# EAGLE design piezo-driver_v0.9b-R001 (EAGLE 6.5.0)

## Sheet 1 of 3
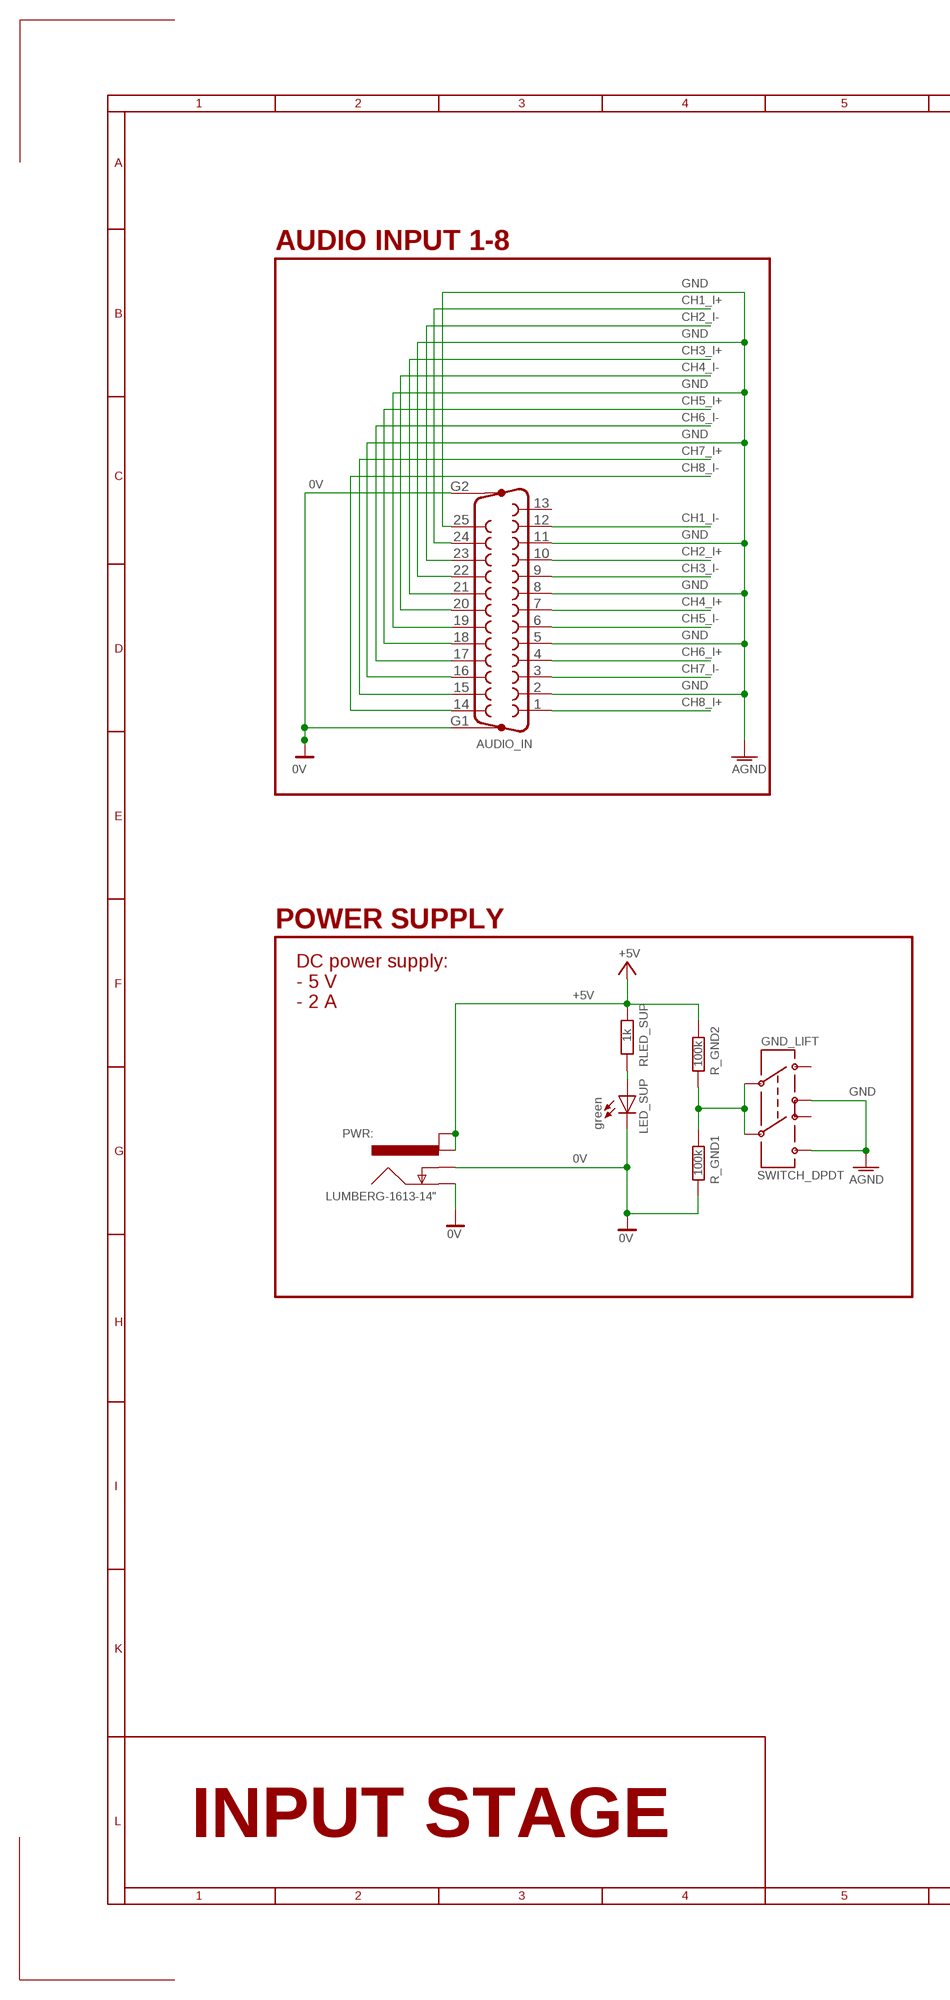
[diagram p0: schematic, sheet 1, part 1 of 2]
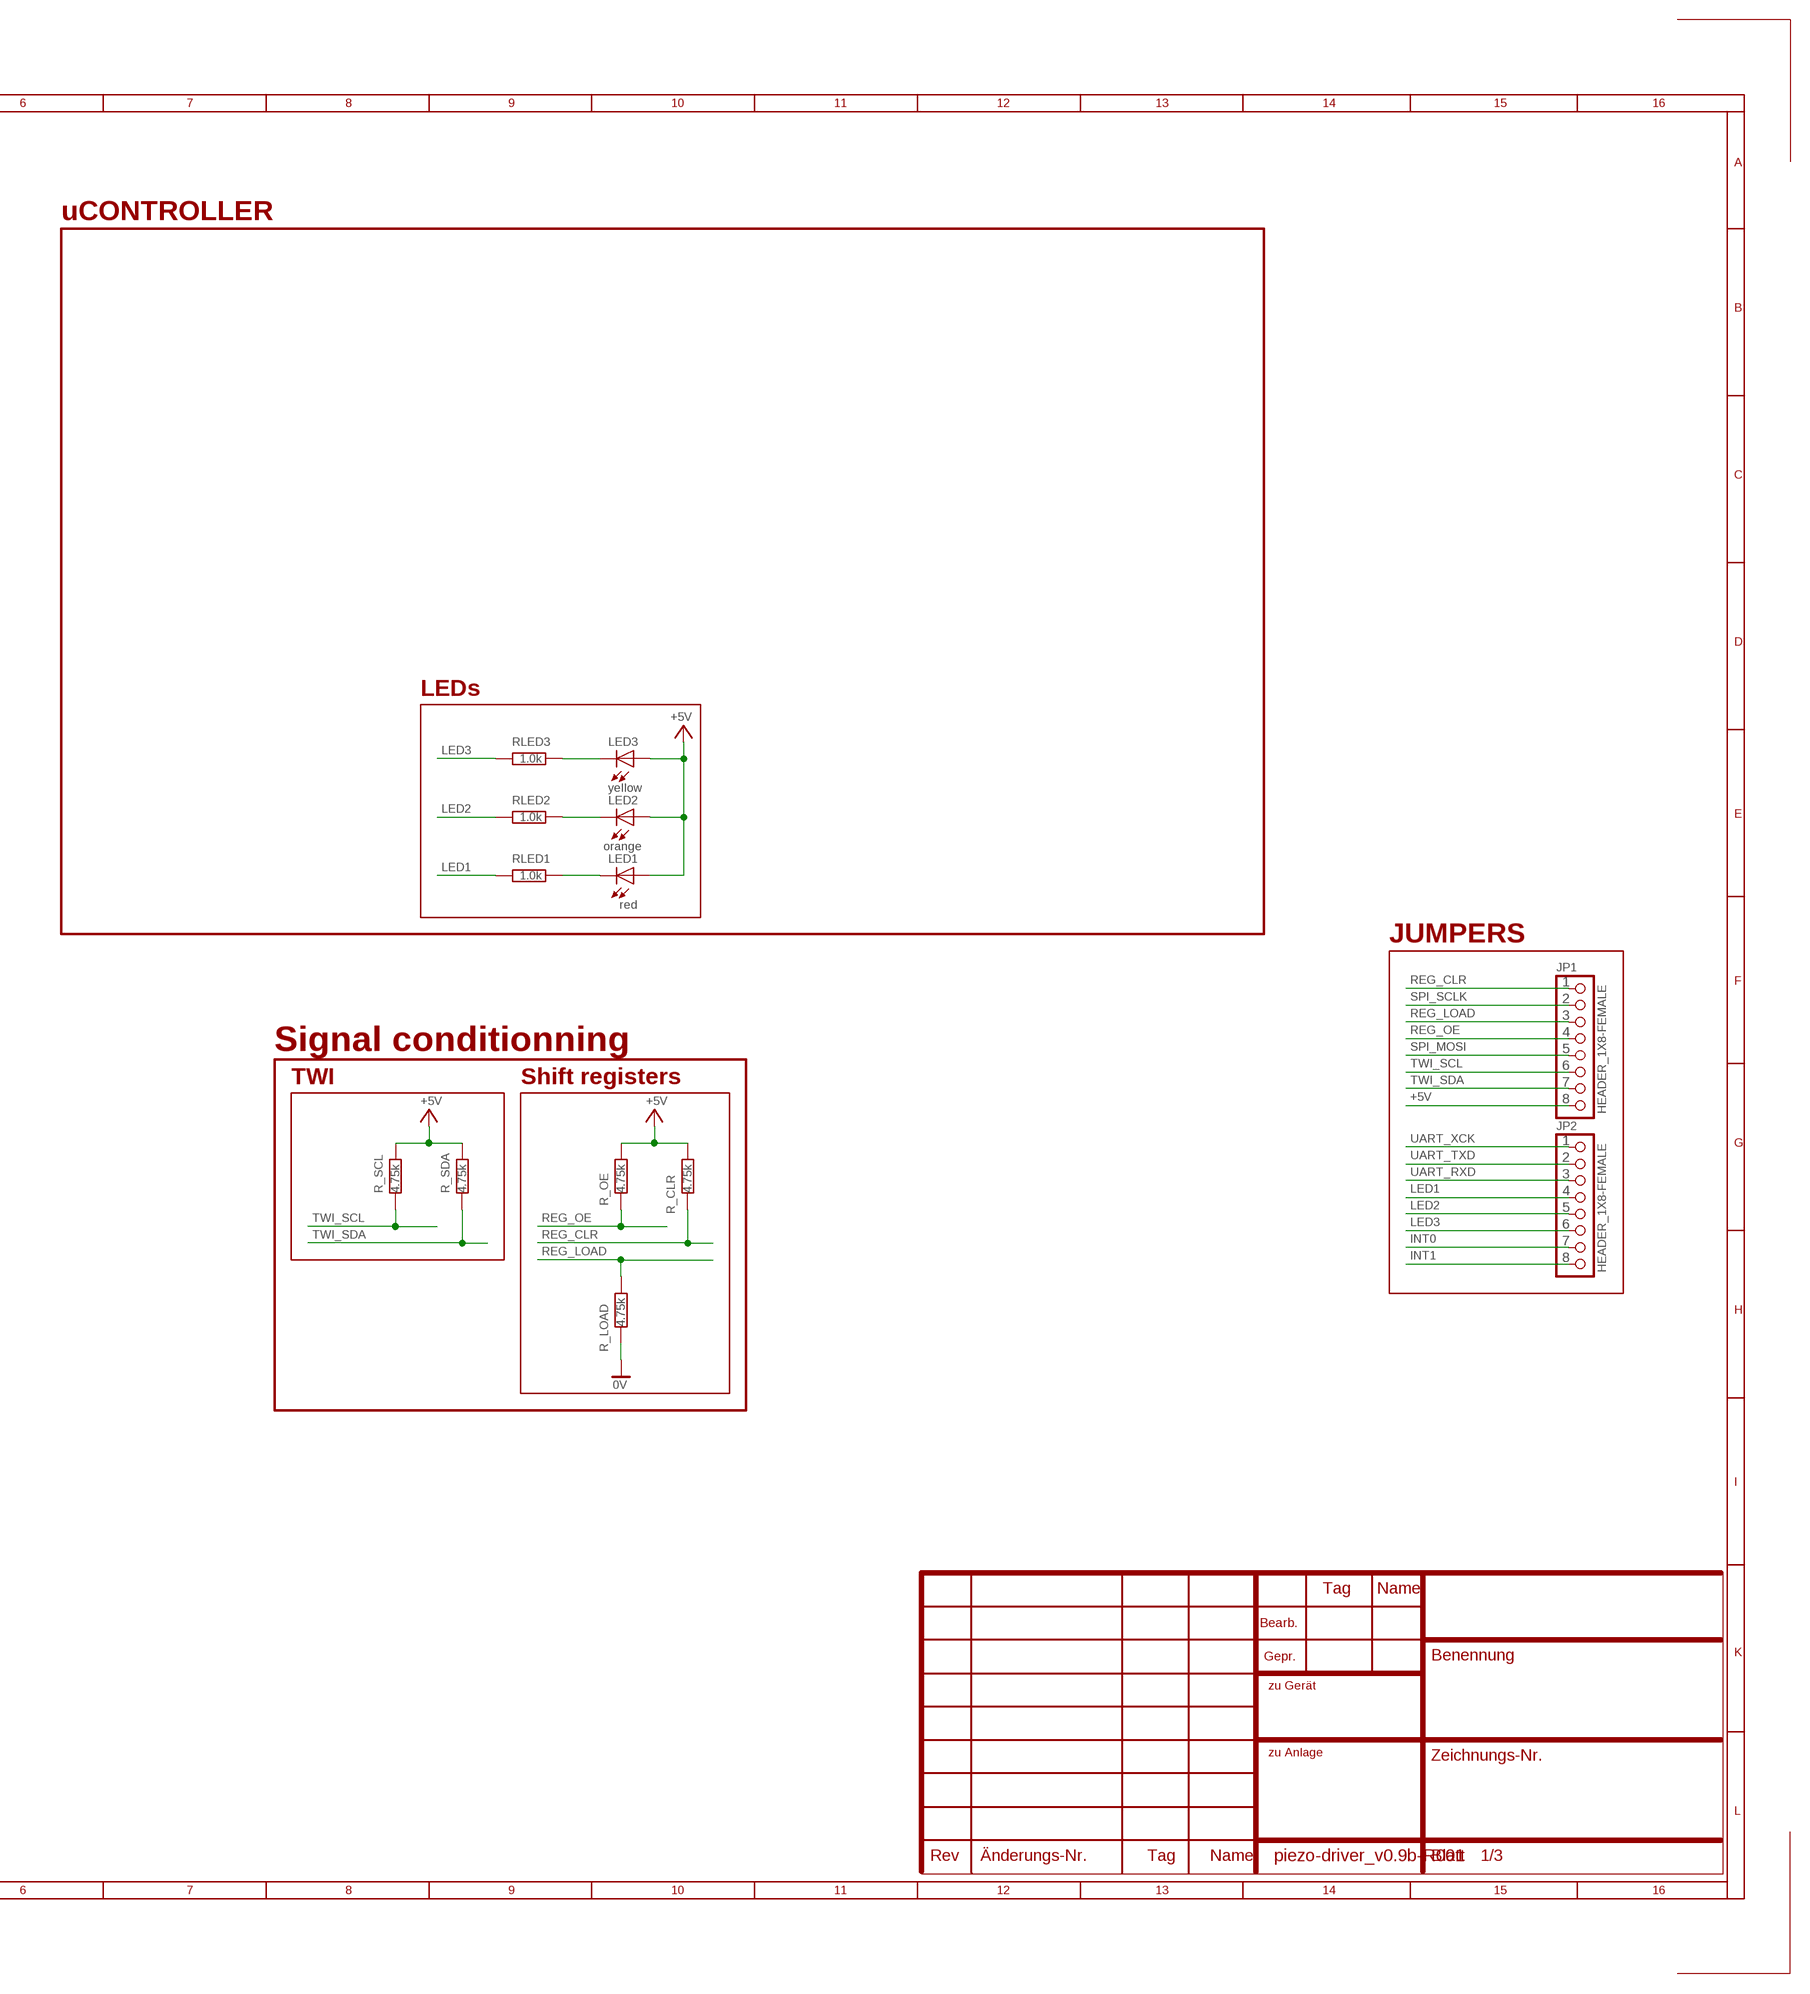
[diagram p1: schematic, sheet 1, part 2 of 2]

### Parts
AUDIO_IN  F25HP  [F25HP]
GND_LIFT  SWITCH_DPDT  [SWITCH_JS202011]
JP1  HEADER_1X8-FEMALE  [1X08_2.54]
JP2  HEADER_1X8-FEMALE  [1X08_2.54]
LED1  red  LED1206  [LED-1206]
LED2  orange  LED1206  [LED-1206]
LED3  yellow  LED1206  [LED-1206]
LED_SUP  green  LED1206  [LED-1206]
PWR:  LUMBERG-1613-14"  [LUMBERG-1613_14]
R_CLR  4.75k  R-EU_R0402  [R0402]
R_GND1  100k  R-EU_R0402  [R0402]
R_GND2  100k  R-EU_R0402  [R0402]
R_LOAD  4.75k  R-EU_R0402  [R0402]
R_OE  4.75k  R-EU_R0402  [R0402]
R_SCL  4.75k  R-EU_R0402  [R0402]
R_SDA  4.75k  R-EU_R0402  [R0402]
RLED1  1.0k  R-EU_R0402  [R0402]
RLED2  1.0k  R-EU_R0402  [R0402]
RLED3  1.0k  R-EU_R0402  [R0402]
RLED_SUP  1k  R-EU_R0402  [R0402]

### Nets
0V: AUDIO_IN.G1 AUDIO_IN.G2 LED_SUP.C PWR:.1(GND) PWR:.2(GND_INS) R_GND1.1 R_LOAD.1 ; also sheet 2,3
+5V: JP1.8 LED1.A LED2.A LED3.A PWR:.3(PWR_1) PWR:.4(PWR_2) R_CLR.2 R_GND2.2 R_OE.2 R_SCL.2 R_SDA.2 RLED_SUP.2 ; also sheet 2,3
CH1_I+: AUDIO_IN.24 ; also sheet 2
CH1_I-: AUDIO_IN.12 ; also sheet 2
CH2_I+: AUDIO_IN.10 ; also sheet 2
CH2_I-: AUDIO_IN.23 ; also sheet 2
CH3_I+: AUDIO_IN.21
CH3_I-: AUDIO_IN.9
CH4_I+: AUDIO_IN.7
CH4_I-: AUDIO_IN.20
CH5_I+: AUDIO_IN.18
CH5_I-: AUDIO_IN.6
CH6_I+: AUDIO_IN.4
CH6_I-: AUDIO_IN.17
CH7_I+: AUDIO_IN.15
CH7_I-: AUDIO_IN.3
CH8_I+: AUDIO_IN.1
CH8_I-: AUDIO_IN.14
GND: AUDIO_IN.2 AUDIO_IN.5 AUDIO_IN.8 AUDIO_IN.11 AUDIO_IN.16 AUDIO_IN.19 AUDIO_IN.22 AUDIO_IN.25 GND_LIFT.1(T1A) GND_LIFT.6(T2A) ; supply symbol labelled AGND
INT0: JP2.7
INT1: JP2.8
LED1: JP2.4 RLED1.1
LED2: JP2.5 RLED2.1
LED3: JP2.6 RLED3.1
N$15: LED_SUP.A RLED_SUP.1
N$68: LED3.C RLED3.2
N$69: LED2.C RLED2.2
N$70: LED1.C RLED1.2
N$1222: GND_LIFT.2(P1) GND_LIFT.5(P2) R_GND1.2 R_GND2.1
REG_CLR: JP1.1 R_CLR.1 ; also sheet 3
REG_LOAD: JP1.3 R_LOAD.2 ; also sheet 3
REG_OE: JP1.4 R_OE.1 ; also sheet 3
SPI_MOSI: JP1.5 ; also sheet 3
SPI_SCLK: JP1.2 ; also sheet 3
TWI_SCL: JP1.6 R_SCL.1 ; also sheet 2
TWI_SDA: JP1.7 R_SDA.1 ; also sheet 2
UART_RXD: JP2.3
UART_TXD: JP2.2
UART_XCK: JP2.1
Unconnected: AUDIO_IN.13 GND_LIFT.3(T1B) GND_LIFT.4(T2B)

### Notes on the sheet
- uCONTROLLER
- AUDIO INPUT 1-8
- LEDs
- POWER SUPPLY
- JUMPERS
- DC power supply:
  - 5 V
  - 2 A
- Signal conditionning
- TWI | Shift registers
- INPUT STAGE

## Sheet 2 of 3
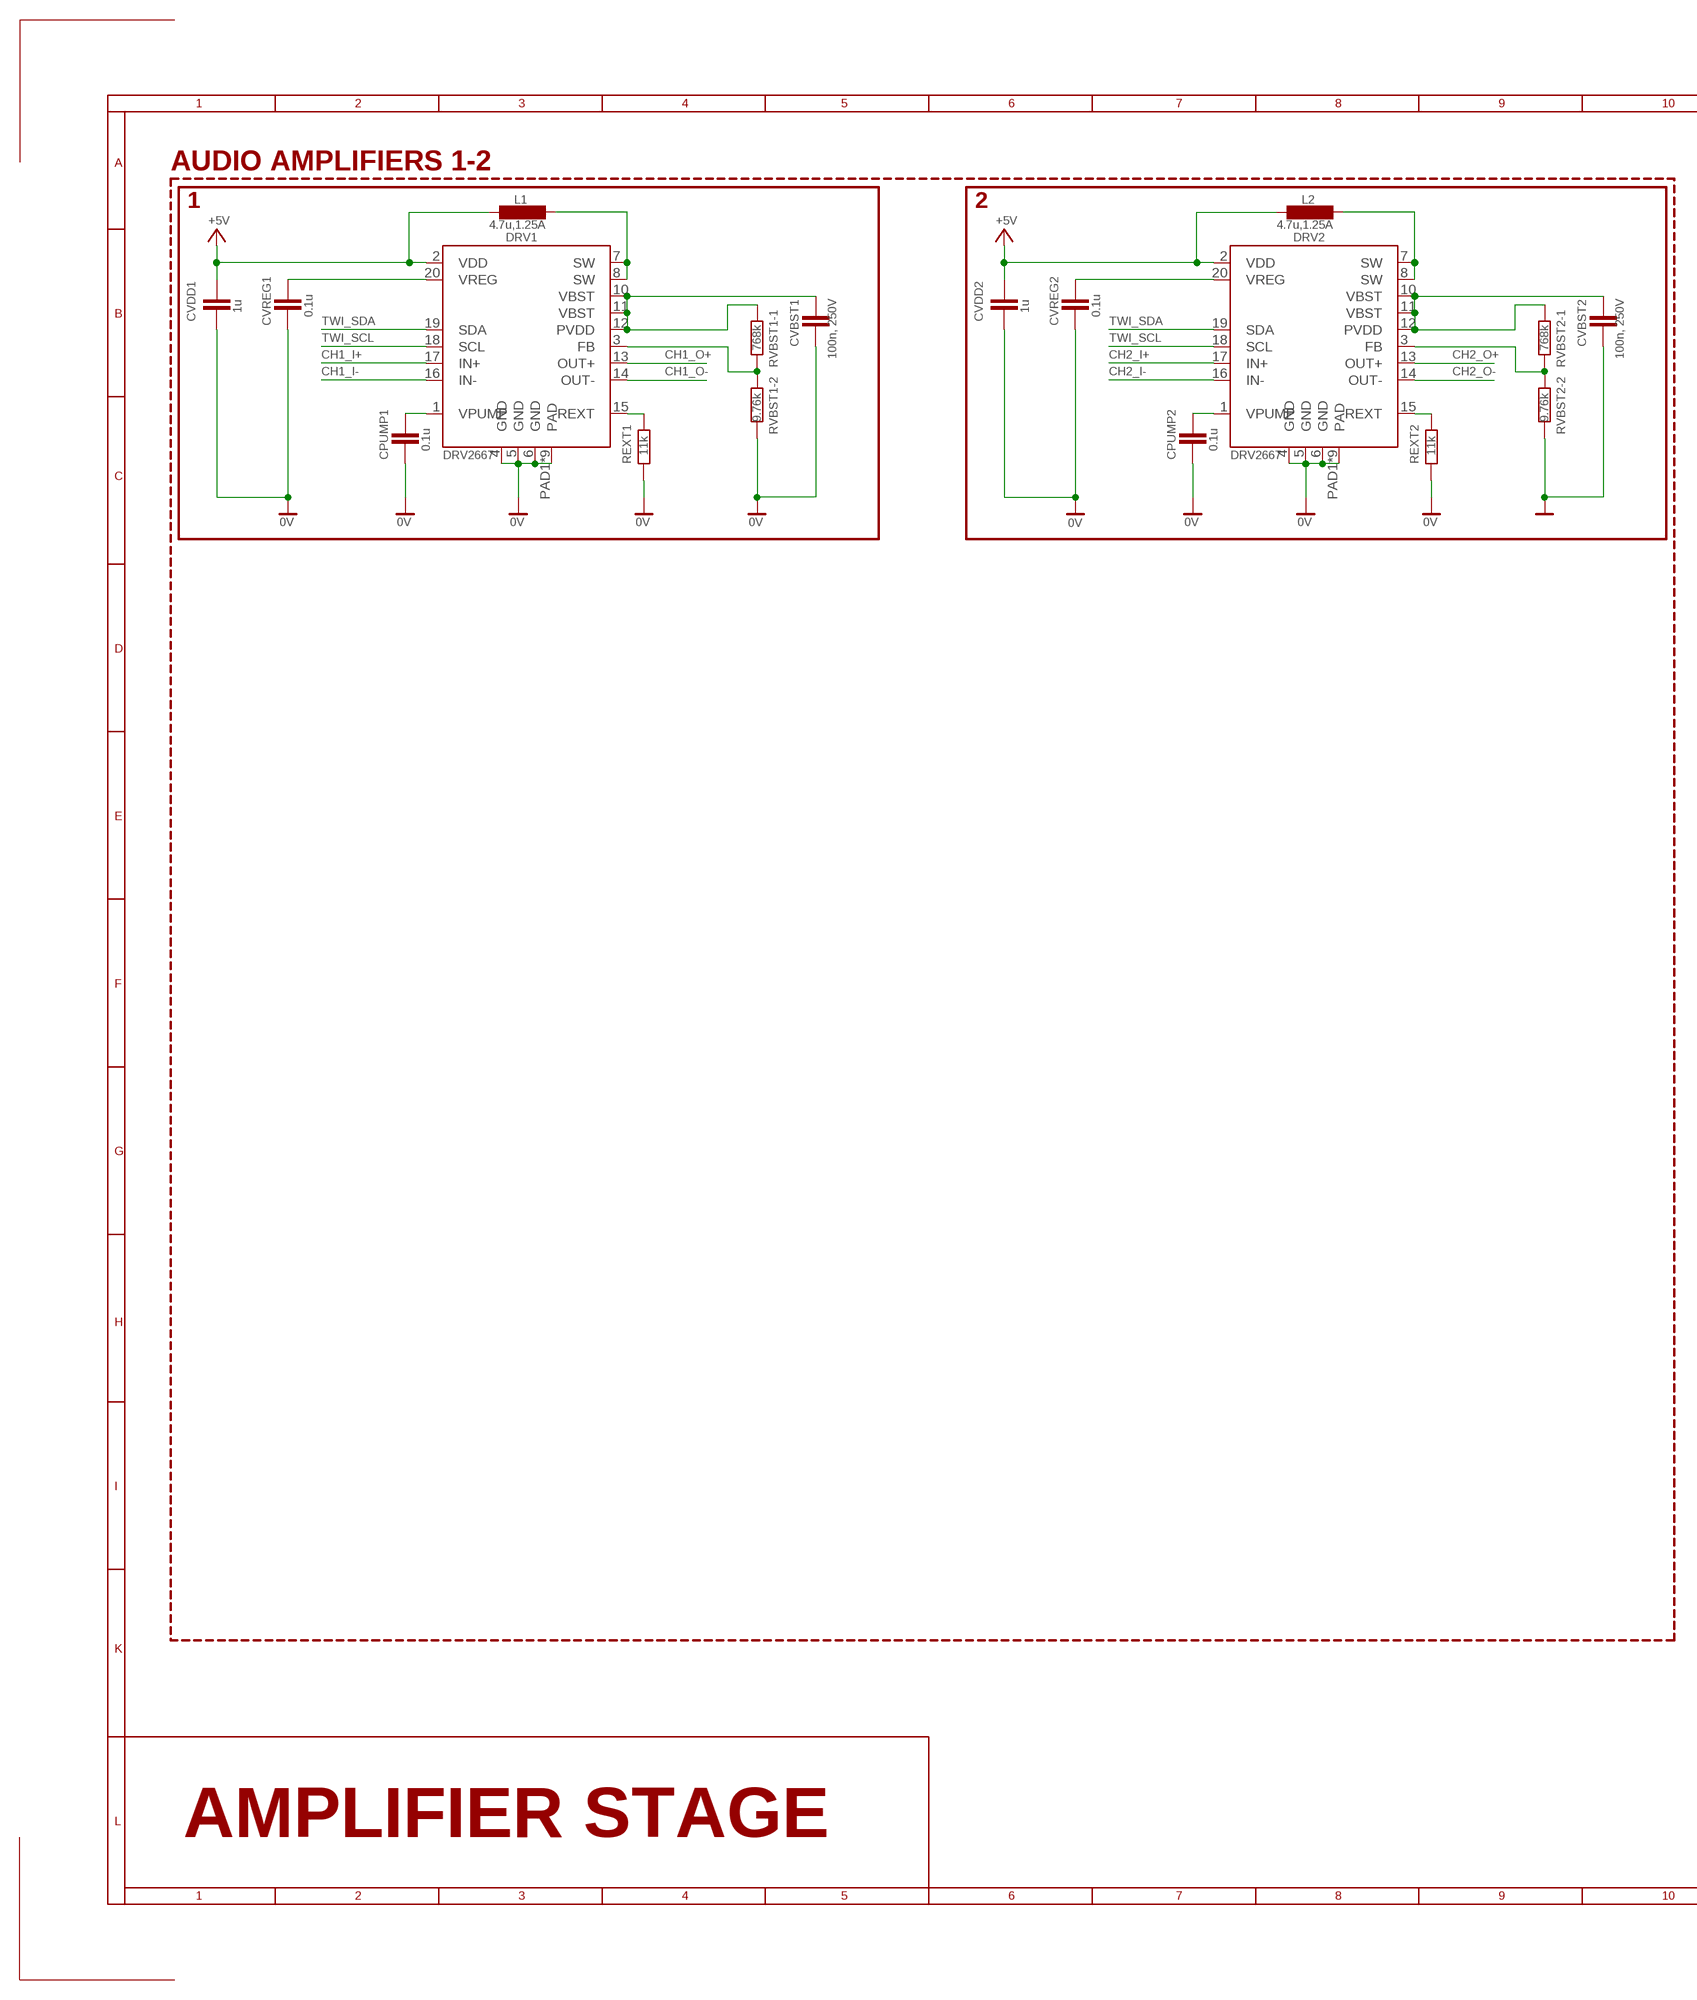
[diagram p2: schematic, sheet 2, part 1 of 2]
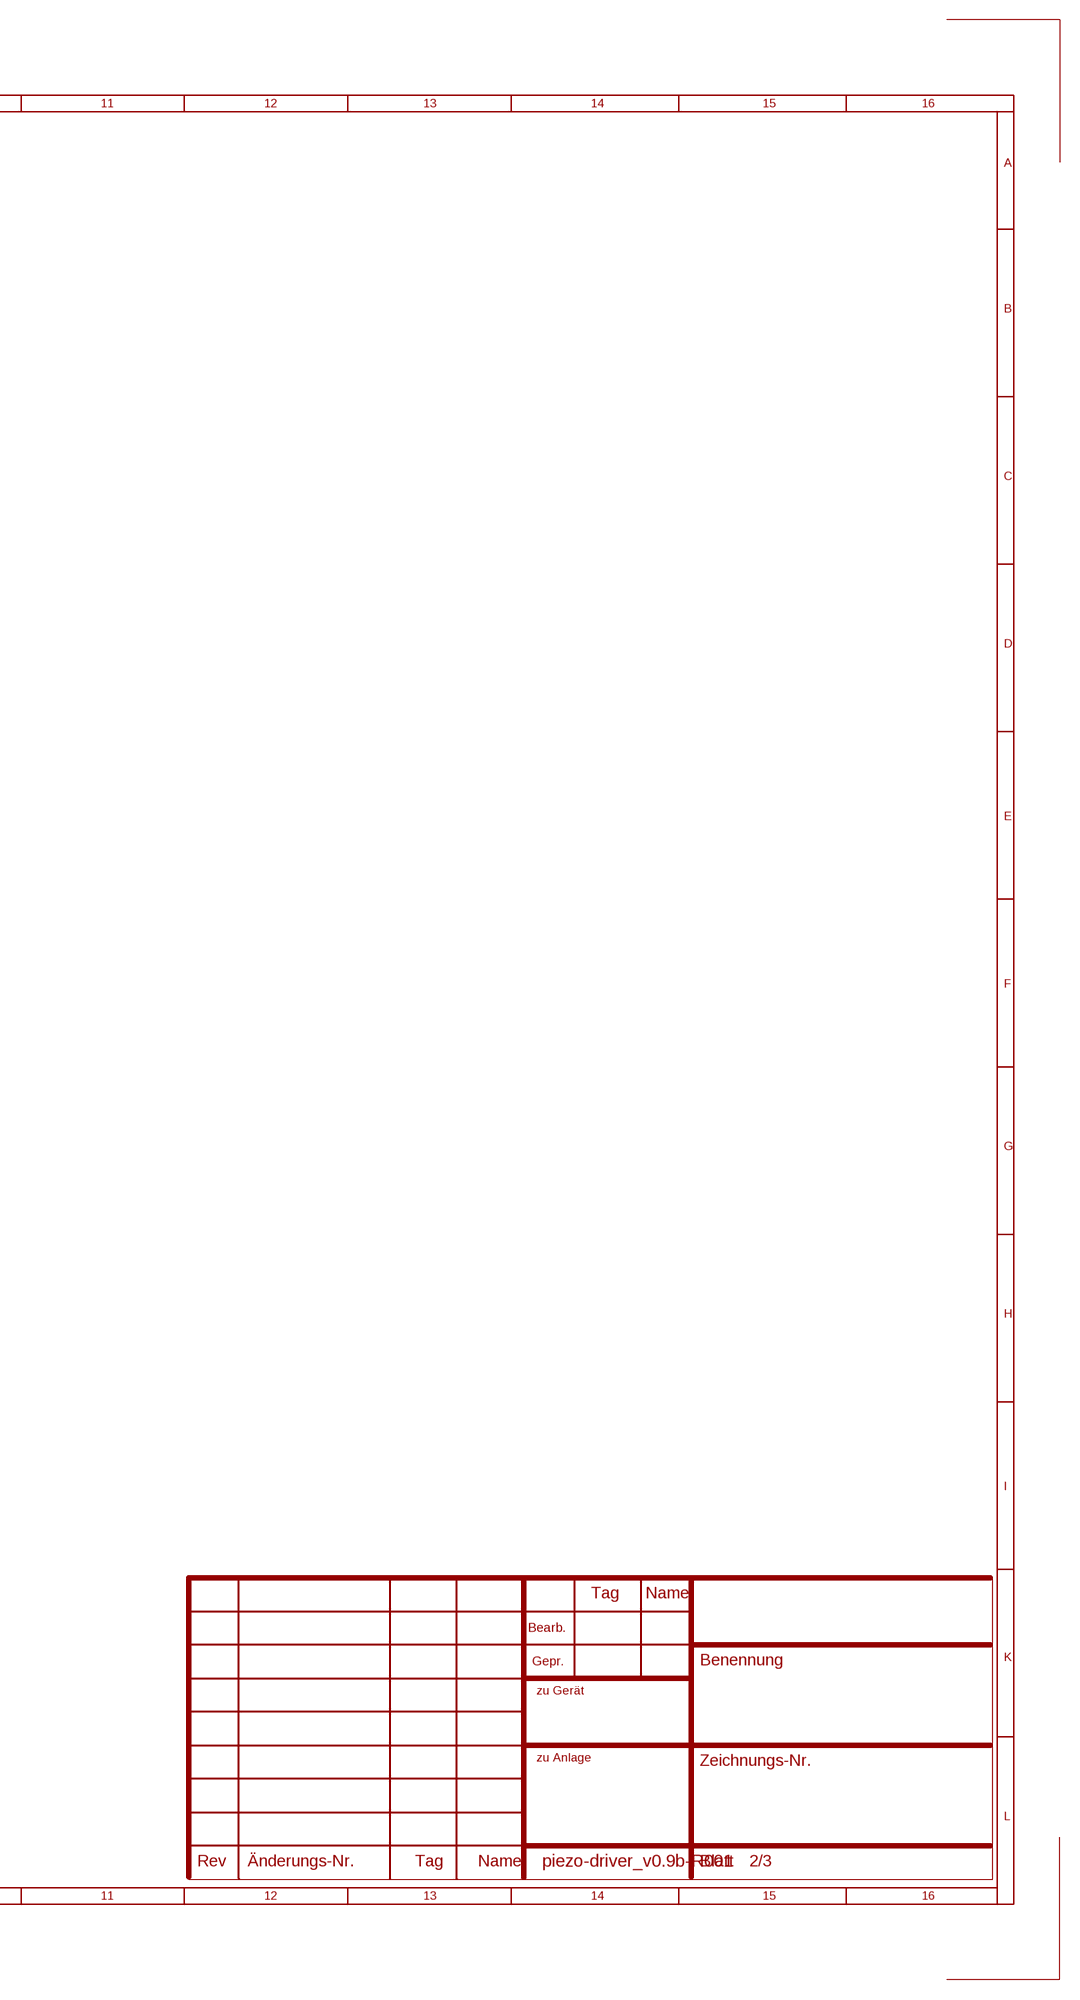
[diagram p3: schematic, sheet 2, part 2 of 2]

### Parts
CPUMP1  0.1u  C-EUC0402  [C0402]
CPUMP2  0.1u  C-EUC0402  [C0402]
CVBST1  100n, 250V  C-EUC0805  [C0805]
CVBST2  100n, 250V  C-EUC0805  [C0805]
CVDD1  1u  C-EUC0402  [C0402]
CVDD2  1u  C-EUC0402  [C0402]
CVREG1  0.1u  C-EUC0402  [C0402]
CVREG2  0.1u  C-EUC0402  [C0402]
DRV1  DRV2667  [QFN-20_9TH]
DRV2  DRV2667  [QFN-20_9TH]
L1  4.7u,1.25A  L-EUL3030  [L3030]
L2  4.7u,1.25A  L-EUL3030  [L3030]
REXT1  11k  R-EU_R0402  [R0402]
REXT2  11k  R-EU_R0402  [R0402]
RVBST1-1  768k  R-EU_R0402  [R0402]
RVBST1-2  9.76k  R-EU_R0402  [R0402]
RVBST2-1  768k  R-EU_R0402  [R0402]
RVBST2-2  9.76k  R-EU_R0402  [R0402]

### Nets
0V: CPUMP1.2 CPUMP2.2 CVBST1.2 CVBST2.2 CVDD1.2 CVDD2.2 CVREG1.2 CVREG2.2 DRV1.4(GND) DRV1.5(GND) DRV1.6(GND) DRV1.PAD1(PAD) DRV1.PAD2(PAD) DRV1.PAD3(PAD) DRV1.PAD4(PAD) DRV1.PAD5(PAD) DRV1.PAD6(PAD) DRV1.PAD7(PAD) DRV1.PAD8(PAD) DRV1.PAD9(PAD) DRV2.4(GND) DRV2.5(GND) DRV2.6(GND) DRV2.PAD1(PAD) DRV2.PAD2(PAD) DRV2.PAD3(PAD) DRV2.PAD4(PAD) DRV2.PAD5(PAD) DRV2.PAD6(PAD) DRV2.PAD7(PAD) DRV2.PAD8(PAD) DRV2.PAD9(PAD) REXT1.1 REXT2.1 RVBST1-2.1 RVBST2-2.1 ; also sheet 1,3
+5V: CVDD1.1 CVDD2.1 DRV1.2(VDD) DRV2.2(VDD) L1.2 L2.2 ; also sheet 1,3
CH1_I+: DRV1.17(IN+) ; also sheet 1
CH1_I-: DRV1.16(IN-) ; also sheet 1
CH1_O+: DRV1.13(OUT+) ; also sheet 3
CH1_O-: DRV1.14(OUT-) ; also sheet 3
CH2_I+: DRV2.17(IN+) ; also sheet 1
CH2_I-: DRV2.16(IN-) ; also sheet 1
CH2_O+: DRV2.13(OUT+) ; also sheet 3
CH2_O-: DRV2.14(OUT-) ; also sheet 3
N$2: DRV1.7(SW) DRV1.8(SW) L1.1
N$3: CVBST1.1 DRV1.10(VBST) DRV1.11(VBST) DRV1.12(PVDD) RVBST1-1.2
N$4: DRV1.3(FB) RVBST1-1.1 RVBST1-2.2
N$5: DRV1.15(REXT) REXT1.2
N$6: CPUMP1.1 DRV1.1(VPUMP)
N$7: CVREG1.1 DRV1.20(VREG)
N$21: DRV2.7(SW) DRV2.8(SW) L2.1
N$22: CVBST2.1 DRV2.10(VBST) DRV2.11(VBST) DRV2.12(PVDD) RVBST2-1.2
N$23: DRV2.3(FB) RVBST2-1.1 RVBST2-2.2
N$24: DRV2.15(REXT) REXT2.2
N$25: CPUMP2.1 DRV2.1(VPUMP)
N$26: CVREG2.1 DRV2.20(VREG)
TWI_SCL: DRV1.18(SCL) DRV2.18(SCL) ; also sheet 1
TWI_SDA: DRV1.19(SDA) DRV2.19(SDA) ; also sheet 1

### Notes on the sheet
- AUDIO AMPLIFIERS 1-2
- 1 | 2
- AMPLIFIER STAGE

## Sheet 3 of 3
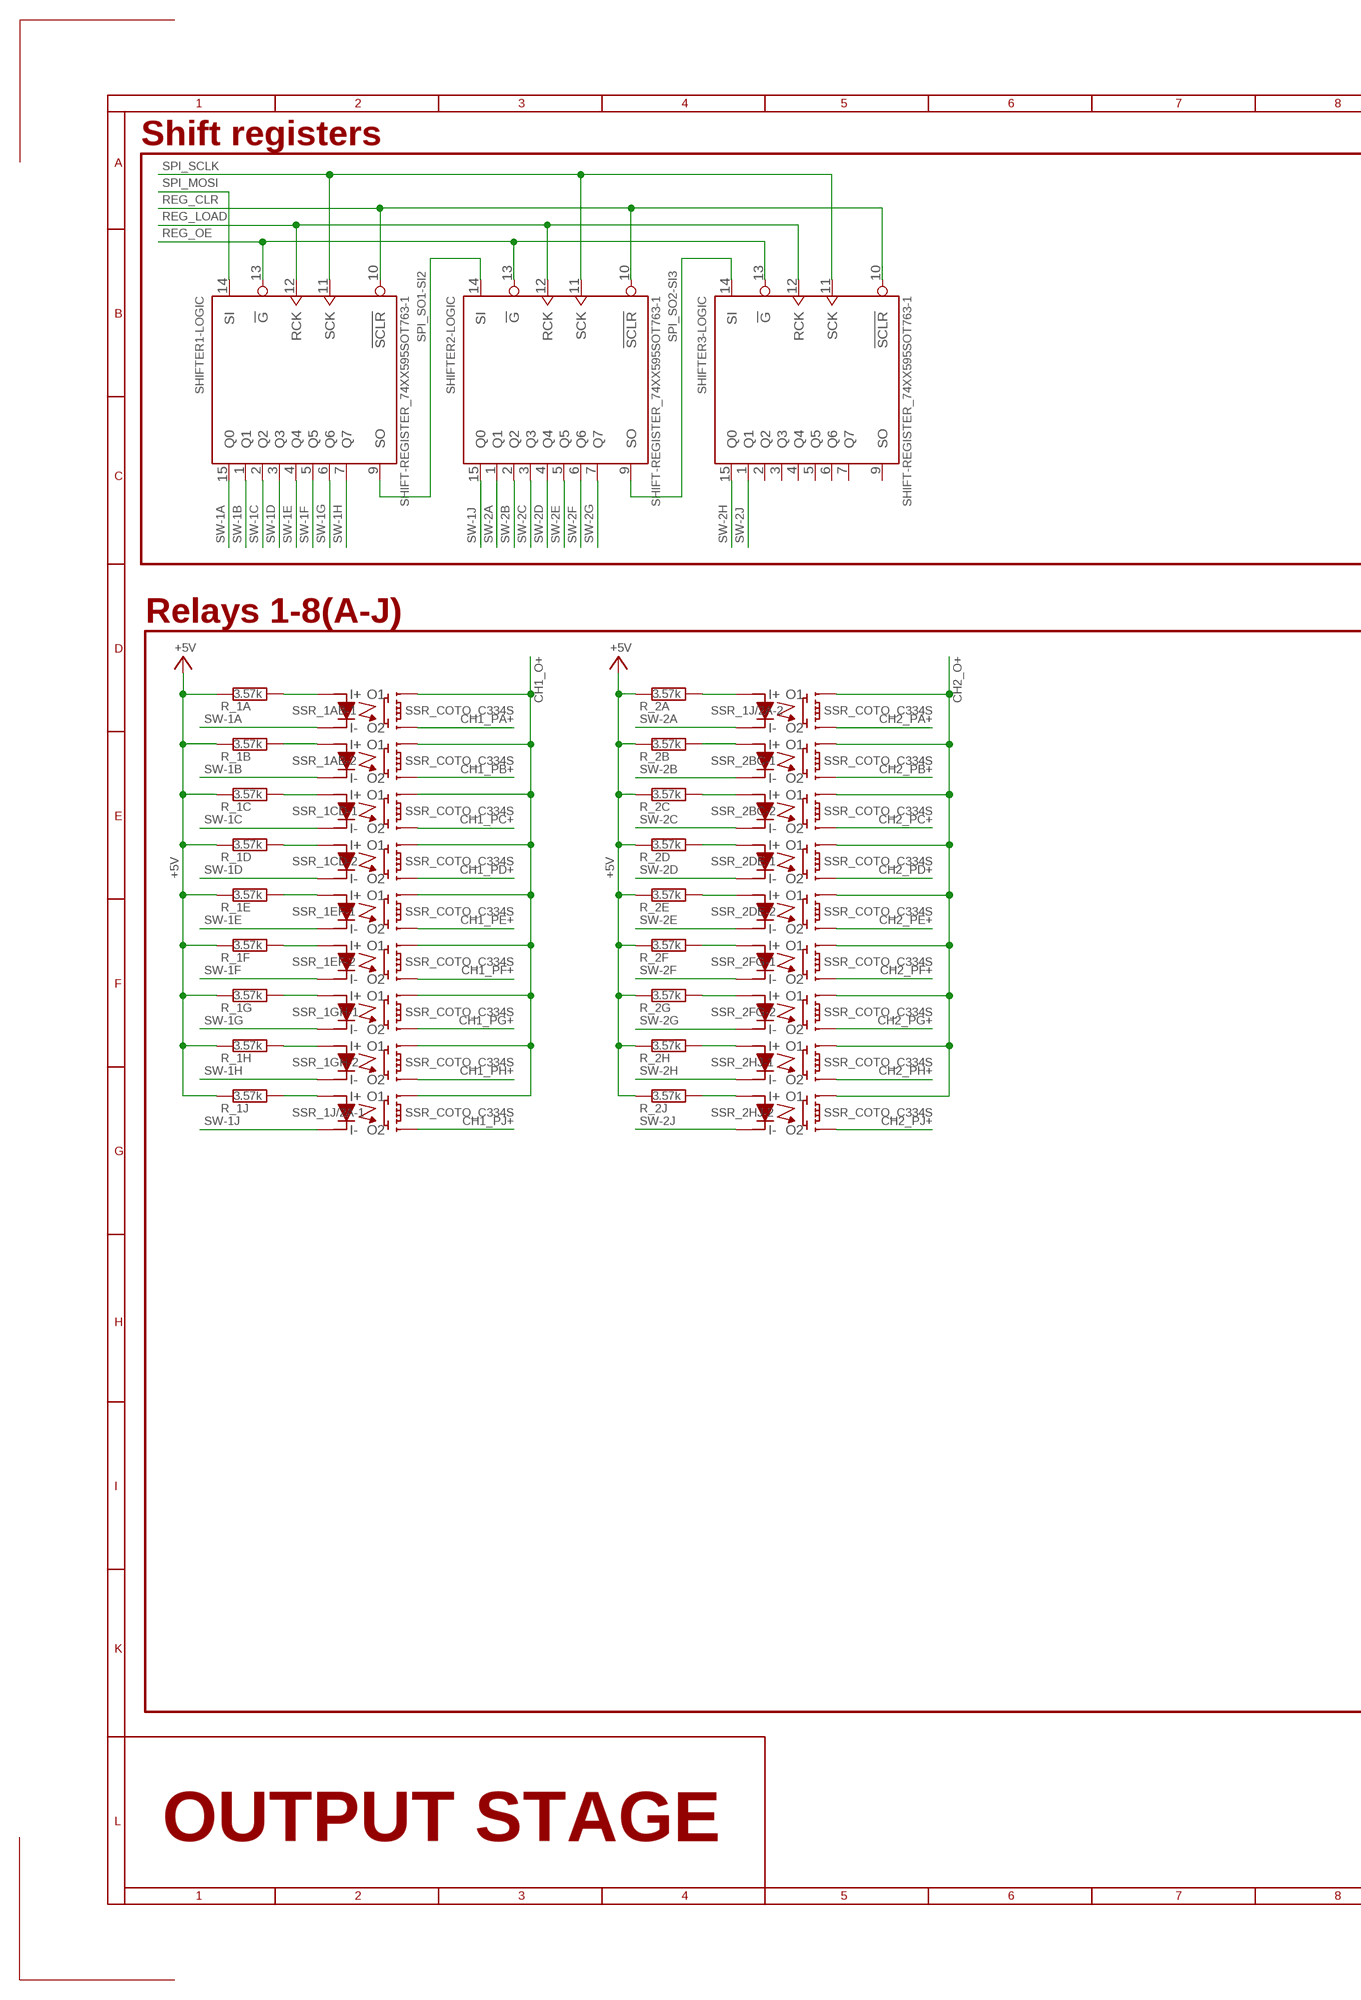
[diagram p4: schematic, sheet 3, part 1 of 2]
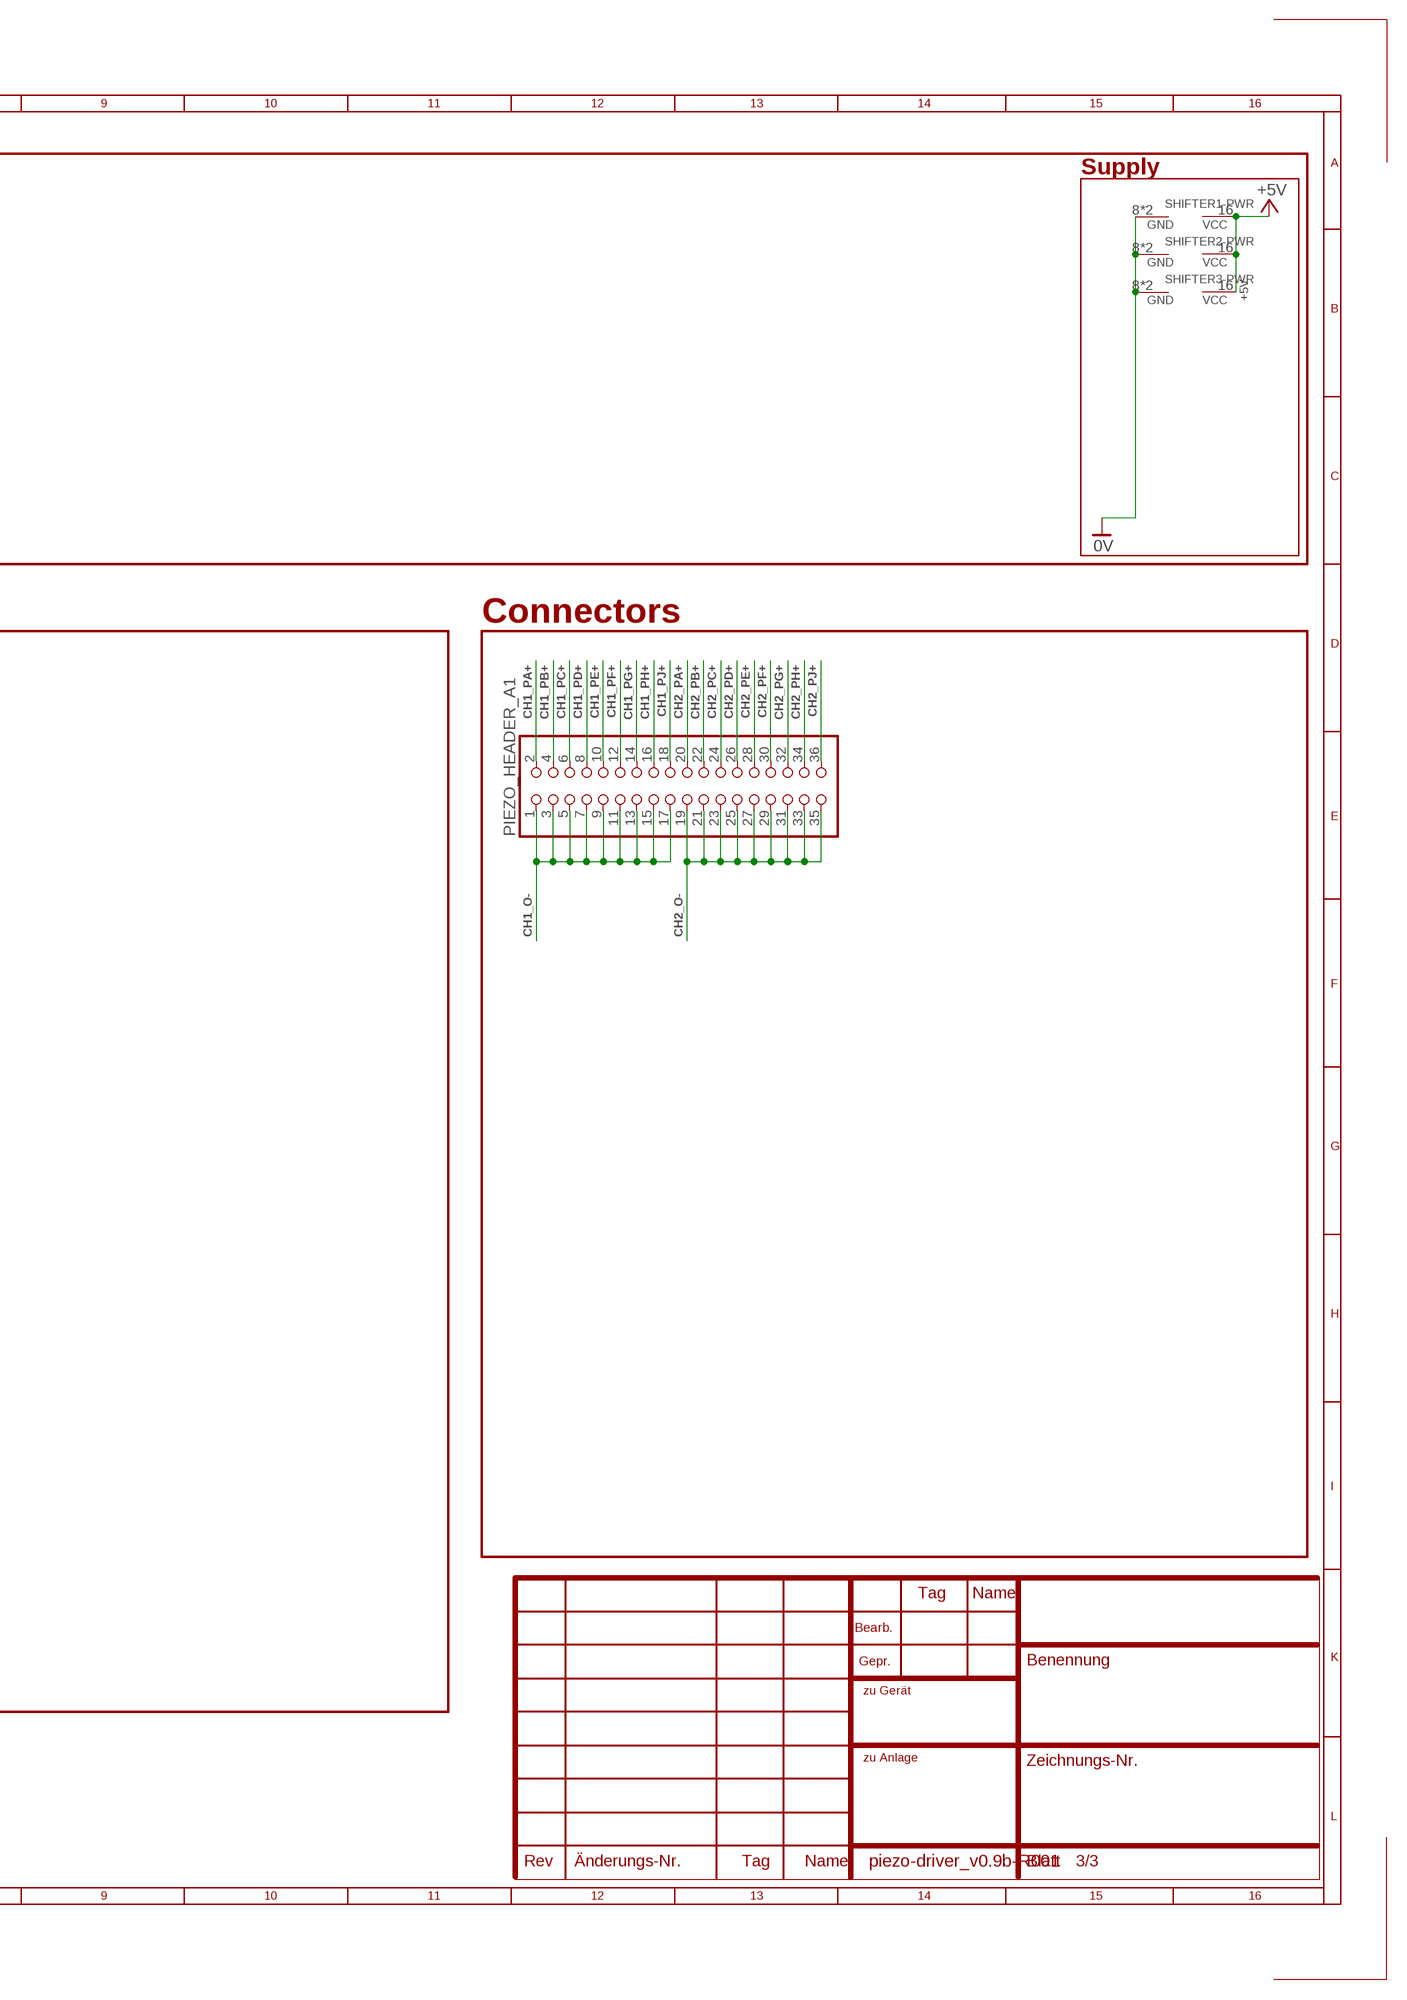
[diagram p5: schematic, sheet 3, part 2 of 2]

### Parts
PIEZO_HEADER_A1  PINHD-2X18  [2X18]
R_1A  3.57k  R-EU_R0402  [R0402]
R_1B  3.57k  R-EU_R0402  [R0402]
R_1C  3.57k  R-EU_R0402  [R0402]
R_1D  3.57k  R-EU_R0402  [R0402]
R_1E  3.57k  R-EU_R0402  [R0402]
R_1F  3.57k  R-EU_R0402  [R0402]
R_1G  3.57k  R-EU_R0402  [R0402]
R_1H  3.57k  R-EU_R0402  [R0402]
R_1J  3.57k  R-EU_R0402  [R0402]
R_2A  3.57k  R-EU_R0402  [R0402]
R_2B  3.57k  R-EU_R0402  [R0402]
R_2C  3.57k  R-EU_R0402  [R0402]
R_2D  3.57k  R-EU_R0402  [R0402]
R_2E  3.57k  R-EU_R0402  [R0402]
R_2F  3.57k  R-EU_R0402  [R0402]
R_2G  3.57k  R-EU_R0402  [R0402]
R_2H  3.57k  R-EU_R0402  [R0402]
R_2J  3.57k  R-EU_R0402  [R0402]
SHIFTER1  SHIFT-REGISTER_74XX595SOT763-1  [SOT763-1]
SHIFTER2  SHIFT-REGISTER_74XX595SOT763-1  [SOT763-1]
SHIFTER3  SHIFT-REGISTER_74XX595SOT763-1  [SOT763-1]
SSR_1AB  SSR_COTO_C334S  [SOP8]
SSR_1CD  SSR_COTO_C334S  [SOP8]
SSR_1EF  SSR_COTO_C334S  [SOP8]
SSR_1GH  SSR_COTO_C334S  [SOP8]
SSR_1J/2A  SSR_COTO_C334S  [SOP8]
SSR_2BC  SSR_COTO_C334S  [SOP8]
SSR_2DE  SSR_COTO_C334S  [SOP8]
SSR_2FG  SSR_COTO_C334S  [SOP8]
SSR_2HJ  SSR_COTO_C334S  [SOP8]

### Nets
0V: SHIFTER1.8(-PWR:GND) SHIFTER1.PAD(-PWR:GND) SHIFTER2.8(-PWR:GND) SHIFTER2.PAD(-PWR:GND) SHIFTER3.8(-PWR:GND) SHIFTER3.PAD(-PWR:GND) ; also sheet 1,2
+5V: R_1A.2 R_1B.2 R_1C.2 R_1D.2 R_1E.2 R_1F.2 R_1G.2 R_1H.2 R_1J.2 R_2A.2 R_2B.2 R_2C.2 R_2D.2 R_2E.2 R_2F.2 R_2G.2 R_2H.2 R_2J.2 SHIFTER1.16(-PWR:VCC) SHIFTER2.16(-PWR:VCC) SHIFTER3.16(-PWR:VCC) ; also sheet 1,2
CH1_O+: SSR_1AB.5(-2:O1) SSR_1AB.7(-1:O1) SSR_1CD.5(-2:O1) SSR_1CD.7(-1:O1) SSR_1EF.5(-2:O1) SSR_1EF.7(-1:O1) SSR_1GH.5(-2:O1) SSR_1GH.7(-1:O1) SSR_1J/2A.7(-1:O1) ; also sheet 2
CH1_O-: PIEZO_HEADER_A1.1 PIEZO_HEADER_A1.3 PIEZO_HEADER_A1.5 PIEZO_HEADER_A1.7 PIEZO_HEADER_A1.9 PIEZO_HEADER_A1.11 PIEZO_HEADER_A1.13 PIEZO_HEADER_A1.15 PIEZO_HEADER_A1.17 ; also sheet 2
CH1_PA+: PIEZO_HEADER_A1.2 SSR_1AB.8(-1:O2)
CH1_PB+: PIEZO_HEADER_A1.4 SSR_1AB.6(-2:O2)
CH1_PC+: PIEZO_HEADER_A1.6 SSR_1CD.8(-1:O2)
CH1_PD+: PIEZO_HEADER_A1.8 SSR_1CD.6(-2:O2)
CH1_PE+: PIEZO_HEADER_A1.10 SSR_1EF.8(-1:O2)
CH1_PF+: PIEZO_HEADER_A1.12 SSR_1EF.6(-2:O2)
CH1_PG+: PIEZO_HEADER_A1.14 SSR_1GH.8(-1:O2)
CH1_PH+: PIEZO_HEADER_A1.16 SSR_1GH.6(-2:O2)
CH1_PJ+: PIEZO_HEADER_A1.18 SSR_1J/2A.8(-1:O2)
CH2_O+: SSR_1J/2A.5(-2:O1) SSR_2BC.5(-2:O1) SSR_2BC.7(-1:O1) SSR_2DE.5(-2:O1) SSR_2DE.7(-1:O1) SSR_2FG.5(-2:O1) SSR_2FG.7(-1:O1) SSR_2HJ.5(-2:O1) SSR_2HJ.7(-1:O1) ; also sheet 2
CH2_O-: PIEZO_HEADER_A1.19 PIEZO_HEADER_A1.21 PIEZO_HEADER_A1.23 PIEZO_HEADER_A1.25 PIEZO_HEADER_A1.27 PIEZO_HEADER_A1.29 PIEZO_HEADER_A1.31 PIEZO_HEADER_A1.33 PIEZO_HEADER_A1.35 ; also sheet 2
CH2_PA+: PIEZO_HEADER_A1.20 SSR_1J/2A.6(-2:O2)
CH2_PB+: PIEZO_HEADER_A1.22 SSR_2BC.8(-1:O2)
CH2_PC+: PIEZO_HEADER_A1.24 SSR_2BC.6(-2:O2)
CH2_PD+: PIEZO_HEADER_A1.26 SSR_2DE.8(-1:O2)
CH2_PE+: PIEZO_HEADER_A1.28 SSR_2DE.6(-2:O2)
CH2_PF+: PIEZO_HEADER_A1.30 SSR_2FG.8(-1:O2)
CH2_PG+: PIEZO_HEADER_A1.32 SSR_2FG.6(-2:O2)
CH2_PH+: PIEZO_HEADER_A1.34 SSR_2HJ.8(-1:O2)
CH2_PJ+: PIEZO_HEADER_A1.36 SSR_2HJ.6(-2:O2)
N$96: R_1A.1 SSR_1AB.1(-1:I+)
N$97: R_1B.1 SSR_1AB.3(-2:I+)
N$100: R_1C.1 SSR_1CD.1(-1:I+)
N$101: R_1D.1 SSR_1CD.3(-2:I+)
N$102: R_1E.1 SSR_1EF.1(-1:I+)
N$103: R_1F.1 SSR_1EF.3(-2:I+)
N$104: R_1G.1 SSR_1GH.1(-1:I+)
N$105: R_1H.1 SSR_1GH.3(-2:I+)
N$106: R_1J.1 SSR_1J/2A.1(-1:I+)
N$107: R_2A.1 SSR_1J/2A.3(-2:I+)
N$108: R_2B.1 SSR_2BC.1(-1:I+)
N$109: R_2C.1 SSR_2BC.3(-2:I+)
N$119: R_2D.1 SSR_2DE.1(-1:I+)
N$120: R_2E.1 SSR_2DE.3(-2:I+)
N$121: R_2F.1 SSR_2FG.1(-1:I+)
N$122: R_2J.1 SSR_2HJ.3(-2:I+)
N$123: R_2H.1 SSR_2HJ.1(-1:I+)
N$124: R_2G.1 SSR_2FG.3(-2:I+)
REG_CLR: SHIFTER1.10(-LOGIC:!SCLR) SHIFTER2.10(-LOGIC:!SCLR) SHIFTER3.10(-LOGIC:!SCLR) ; also sheet 1
REG_LOAD: SHIFTER1.12(-LOGIC:RCK) SHIFTER2.12(-LOGIC:RCK) SHIFTER3.12(-LOGIC:RCK) ; also sheet 1
REG_OE: SHIFTER1.13(-LOGIC:!G) SHIFTER2.13(-LOGIC:!G) SHIFTER3.13(-LOGIC:!G) ; also sheet 1
SPI_MOSI: SHIFTER1.14(-LOGIC:SI) ; also sheet 1
SPI_SCLK: SHIFTER1.11(-LOGIC:SCK) SHIFTER2.11(-LOGIC:SCK) SHIFTER3.11(-LOGIC:SCK) ; also sheet 1
SPI_SO1-SI2: SHIFTER1.9(-LOGIC:SO) SHIFTER2.14(-LOGIC:SI)
SPI_SO2-SI3: SHIFTER2.9(-LOGIC:SO) SHIFTER3.14(-LOGIC:SI)
SW-1A: SHIFTER1.15(-LOGIC:Q0) SSR_1AB.2(-1:I-)
SW-1B: SHIFTER1.1(-LOGIC:Q1) SSR_1AB.4(-2:I-)
SW-1C: SHIFTER1.2(-LOGIC:Q2) SSR_1CD.2(-1:I-)
SW-1D: SHIFTER1.3(-LOGIC:Q3) SSR_1CD.4(-2:I-)
SW-1E: SHIFTER1.4(-LOGIC:Q4) SSR_1EF.2(-1:I-)
SW-1F: SHIFTER1.5(-LOGIC:Q5) SSR_1EF.4(-2:I-)
SW-1G: SHIFTER1.6(-LOGIC:Q6) SSR_1GH.2(-1:I-)
SW-1H: SHIFTER1.7(-LOGIC:Q7) SSR_1GH.4(-2:I-)
SW-1J: SHIFTER2.15(-LOGIC:Q0) SSR_1J/2A.2(-1:I-)
SW-2A: SHIFTER2.1(-LOGIC:Q1) SSR_1J/2A.4(-2:I-)
SW-2B: SHIFTER2.2(-LOGIC:Q2) SSR_2BC.2(-1:I-)
SW-2C: SHIFTER2.3(-LOGIC:Q3) SSR_2BC.4(-2:I-)
SW-2D: SHIFTER2.4(-LOGIC:Q4) SSR_2DE.2(-1:I-)
SW-2E: SHIFTER2.5(-LOGIC:Q5) SSR_2DE.4(-2:I-)
SW-2F: SHIFTER2.6(-LOGIC:Q6) SSR_2FG.2(-1:I-)
SW-2G: SHIFTER2.7(-LOGIC:Q7) SSR_2FG.4(-2:I-)
SW-2H: SHIFTER3.15(-LOGIC:Q0) SSR_2HJ.2(-1:I-)
SW-2J: SHIFTER3.1(-LOGIC:Q1) SSR_2HJ.4(-2:I-)
Unconnected: SHIFTER3.2(-LOGIC:Q2) SHIFTER3.3(-LOGIC:Q3) SHIFTER3.4(-LOGIC:Q4) SHIFTER3.5(-LOGIC:Q5) SHIFTER3.6(-LOGIC:Q6) SHIFTER3.7(-LOGIC:Q7) SHIFTER3.9(-LOGIC:SO)

### Notes on the sheet
- Shift registers
- Supply
- Relays 1-8(A-J) | Connectors
- OUTPUT STAGE

## Library data of the parts
AUDIO_IN = ICST:F25HP: SUB-D; OC_FARNELL: unknown; OC_NEWARK: unknown
CPUMP1 CPUMP2 CVBST1 CVBST2 CVDD1 CVDD2 CVREG1 CVREG2 = SABRe:C-EU: CAPACITOR, European symbol
DRV1 DRV2 = ICST:DRV2667
GND_LIFT = ICST:SWITCH_DPDT
JP1 JP2 = SABRe:HEADER_1X8
L1 L2 = SABRe:L-EU: INDUCTOR, European symbol
LED1-LED3 LED_SUP = SABRe:LED: LEDs Standard schematic elements and footprints for packages: 5mm 3mm 1206 0603
PIEZO_HEADER_A1 = ICST:PINHD-2X18: PIN HEADER
PWR: = SABRe:LUMBERG-1613-14
R_1A R_1B R_1C R_1D R_1E R_1F R_1G R_1H R_1J R_2A R_2B R_2C R_2D R_2E R_2F R_2G R_2H R_2J R_CLR R_GND1 R_GND2 R_LOAD R_OE R_SCL R_SDA REXT1 REXT2 RLED1-RLED3 RLED_SUP RVBST1-1 RVBST1-2 RVBST2-1 RVBST2-2 = SABRe:R-EU_: RESISTOR, European symbol
SHIFTER1-SHIFTER3 = ICST:SHIFT-REGISTER_74XX595
SSR_1AB SSR_1CD SSR_1EF SSR_1GH SSR_1J/2A SSR_2BC SSR_2DE SSR_2FG SSR_2HJ = ICST:SSR_COTO_C334S

## Board
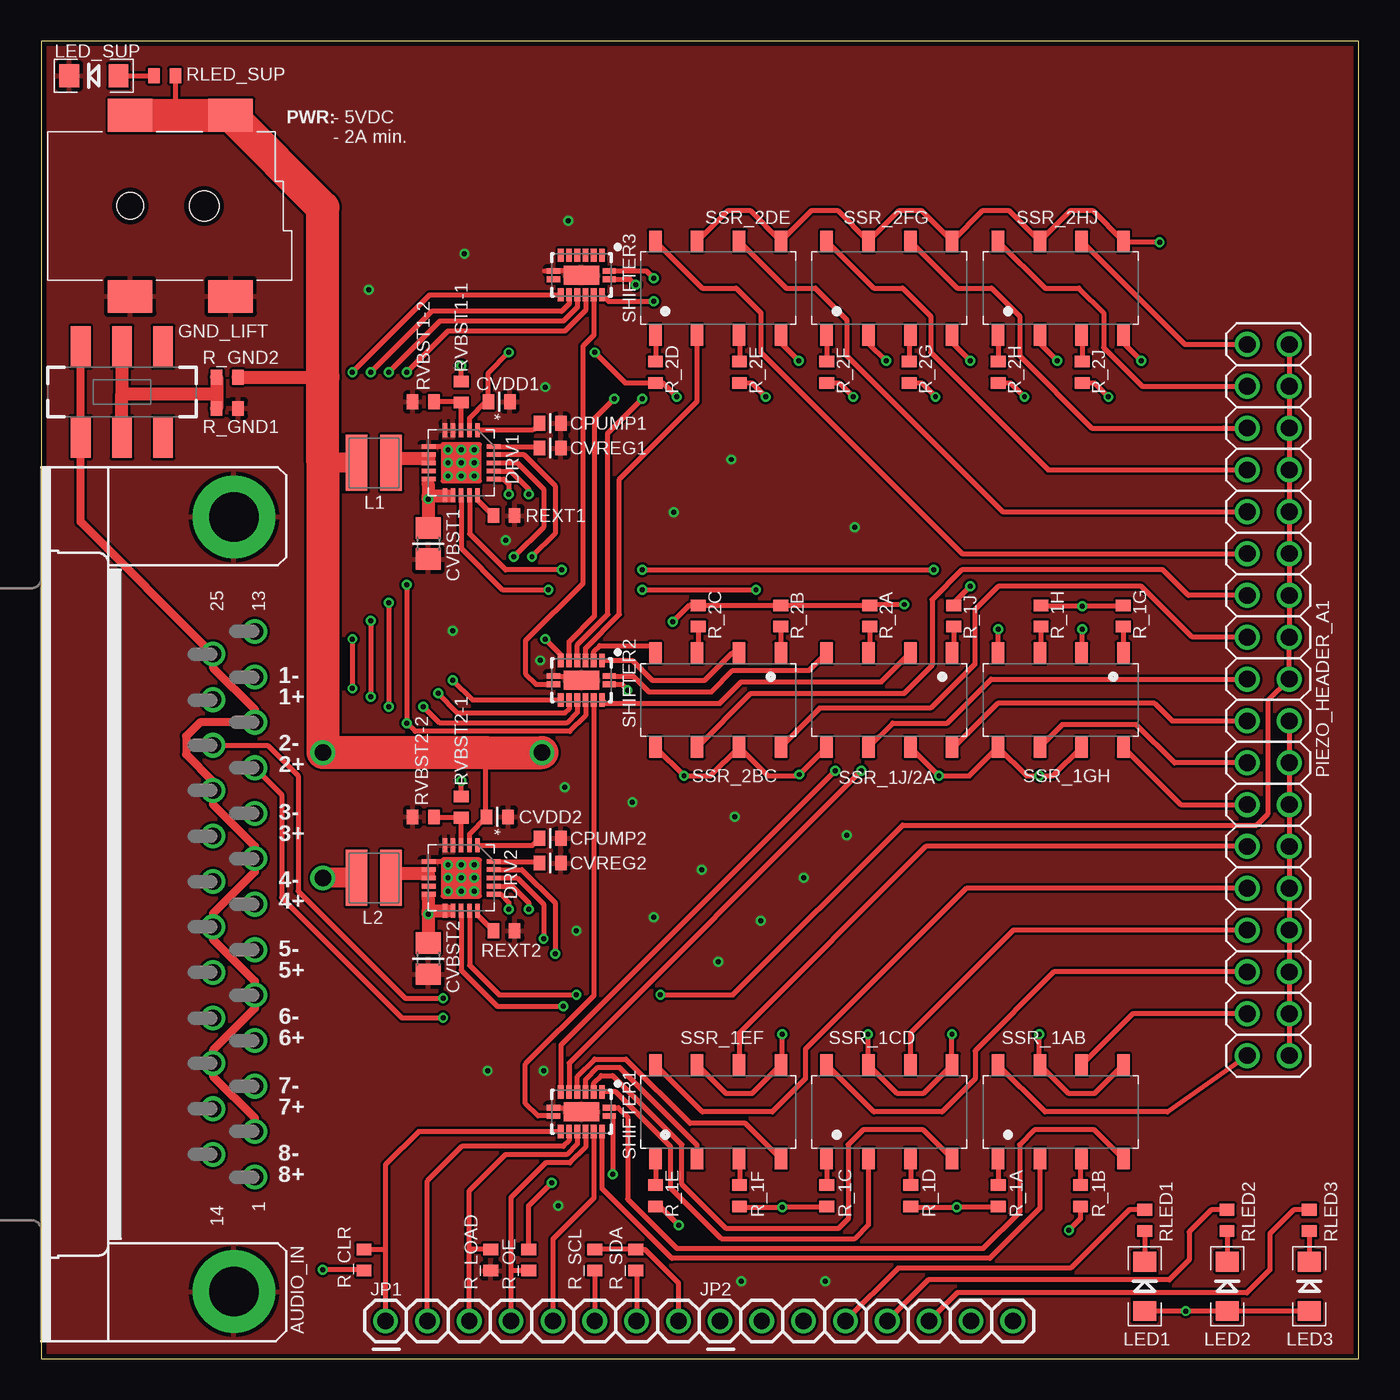
[diagram p6: board, top side]
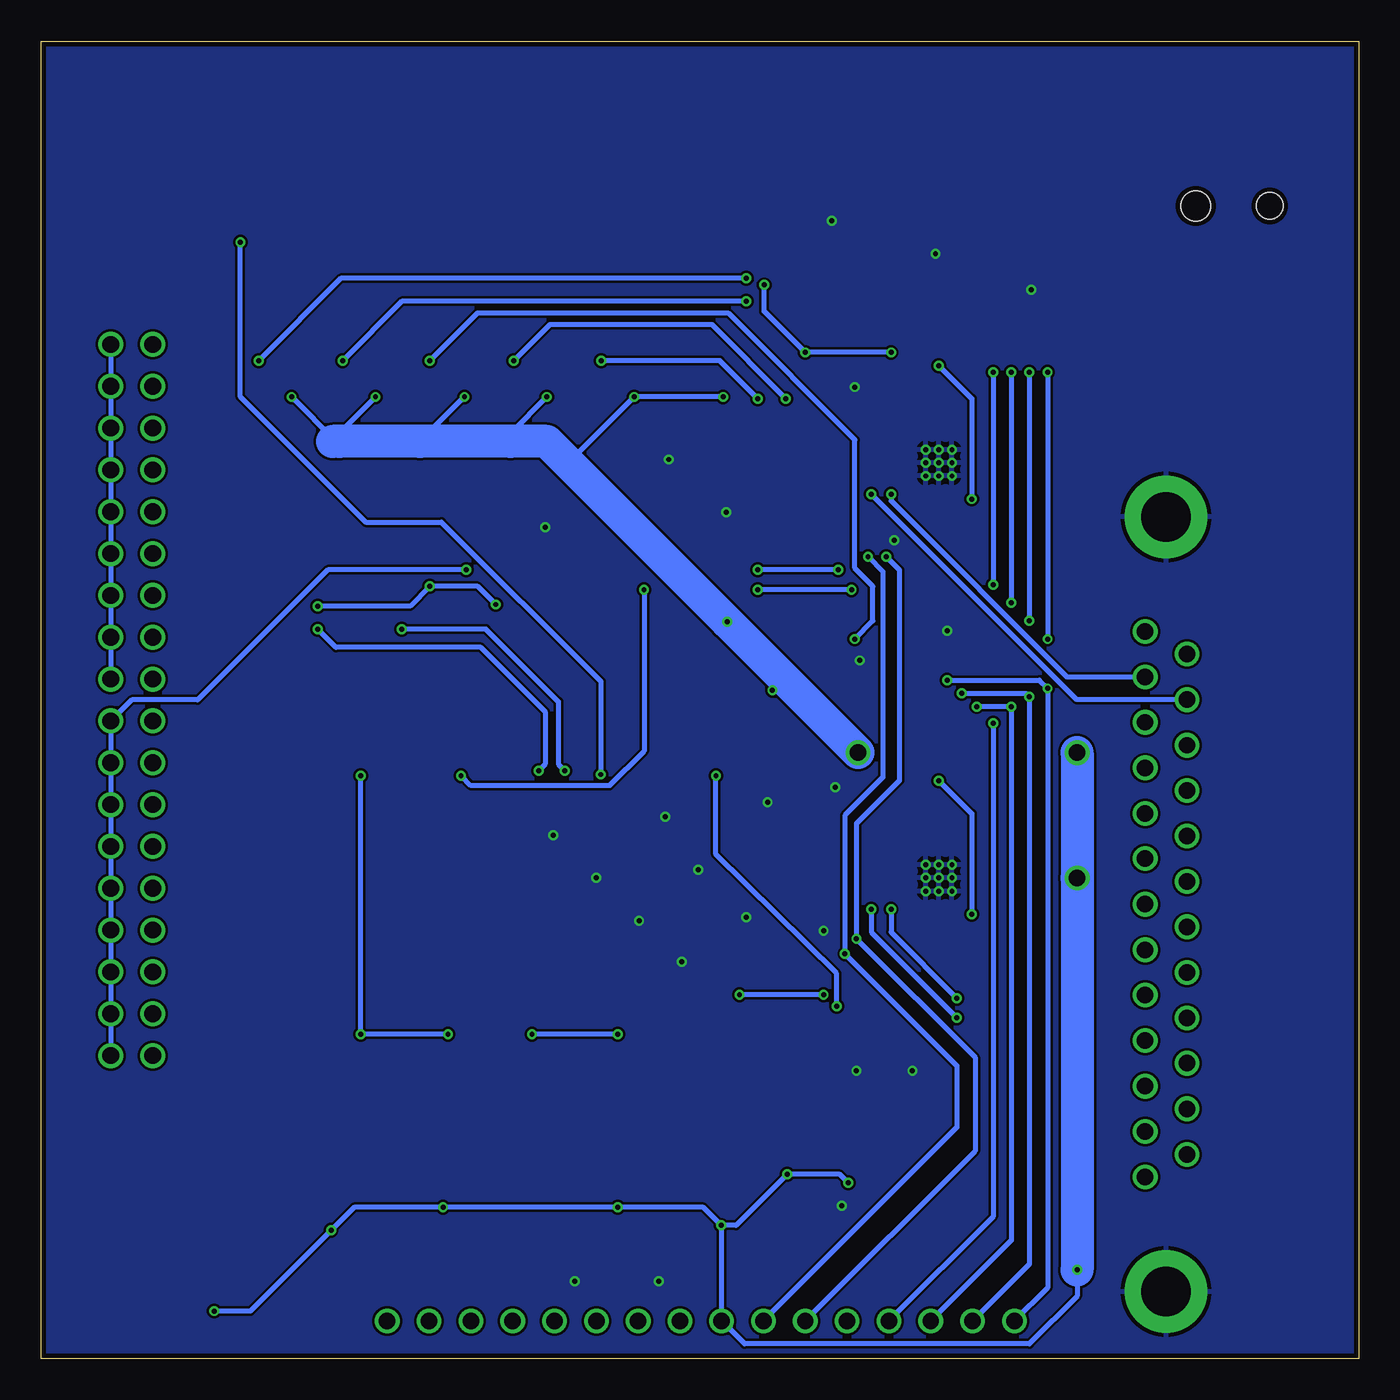
[diagram p7: board, bottom side, seen from below]

Size 80 x 80 mm. Coordinates in mm from the lower left corner, seen from the top.
Outline: 0,0 80,0 80,80 0,80 0,0
Copper layers (1*16): Top 0.035mm / dielectric 1.5mm / Bottom 0.035mm
Design rules "2L-1.6mm-0.15_0.3mm *": minimum track width 0.15mm, minimum drill 0.3mm, track to track 0.15mm, track to pad 0.15mm, pad to pad 0.15mm, via to via 0.15mm, smd to smd 0.15mm, copper to edge 0.3mm, drill to drill 0.5mm, minimum pad ring 0.15mm, minimum via ring 0.15mm, stop-mask expansion 0.1mm, vias tented up to drill 0.8mm, thermal gap 0.25mm

### Footprints (pad centres in the part's own frame; a part is rotated, then mirrored left to right if it is on the bottom)
F25HP = drill 1: 1 -16.561,-1.27; 2 -13.792,-1.27; 3 -11.049,-1.27; 4 -8.28,-1.27; 5 -5.512,-1.27; 6 -2.769,-1.27; 7 0,-1.27; 8 2.769,-1.27; 9 5.512,-1.27; 10 8.28,-1.27; 11 11.049,-1.27; 12 13.792,-1.27; 13 16.561,-1.27; 14 -15.189,1.27; 15 -12.421,1.27; 16 -9.652,1.27; 17 -6.909,1.27; 18 -4.14,1.27; 19 -1.372,1.27; 20 1.372,1.27; 21 4.14,1.27; 22 6.909,1.27; 23 9.652,1.27; 24 12.421,1.27; 25 15.189,1.27 | drill 3 pad 5: G1 -23.52,0; G2 23.52,0
C0402 = smd 0.7 x 0.9: 1 -0.65,0; 2 0.65,0
C0805 = smd 1.3 x 1.5: 1 -0.95,0; 2 0.95,0
QFN-20_9TH = smd 0.85 x 0.28: 1 -1.981,0.991; 2 -1.981,0.508; 3 -1.981,0; 4 -1.981,-0.508; 5 -1.981,-0.991; 11 1.981,-0.991; 12 1.981,-0.508; 13 1.981,0; 14 1.981,0.508; 15 1.981,0.991 | smd 0.28 x 0.85: 6 -0.991,-1.981; 7 -0.508,-1.981; 8 0,-1.981; 9 0.508,-1.981; 10 0.991,-1.981; 16 0.991,1.981; 17 0.508,1.981; 18 0,1.981; 19 -0.508,1.981; 20 -0.991,1.981 | drill 0.3 pad 0.5: PAD1 -0.8,0.8; PAD2 0,0.8; PAD3 0.8,0.8; PAD4 -0.8,0; PAD5 0,0; PAD6 0.8,0; PAD7 -0.8,-0.8; PAD8 0,-0.8; PAD9 0.8,-0.8
SWITCH_JS202011 = smd 1.2 x 2.5: 1 -2.5,-2.75; 2 0,-2.75; 3 2.5,-2.75; 4 2.5,2.75; 5 0,2.75; 6 -2.5,2.75
1X08_2.54 = drill 1: 1 -8.89,0; 2 -6.35,0; 3 -3.81,0; 4 -1.27,0; 5 1.27,0; 6 3.81,0; 7 6.35,0; 8 8.89,0
L3030 = smd 1.3 x 3.4: 1 -1.05,0; 2 1.05,0
LED-1206 = smd 1.2 x 1.4: A -1.5,0; C 1.5,0
2X18 = drill 1.016: 1 -21.59,-1.27; 2 -21.59,1.27; 3 -19.05,-1.27; 4 -19.05,1.27; 5 -16.51,-1.27; 6 -16.51,1.27; 7 -13.97,-1.27; 8 -13.97,1.27; 9 -11.43,-1.27; 10 -11.43,1.27; 11 -8.89,-1.27; 12 -8.89,1.27; 13 -6.35,-1.27; 14 -6.35,1.27; 15 -3.81,-1.27; 16 -3.81,1.27; 17 -1.27,-1.27; 18 -1.27,1.27; 19 1.27,-1.27; 20 1.27,1.27; 21 3.81,-1.27; 22 3.81,1.27; 23 6.35,-1.27; 24 6.35,1.27; 25 8.89,-1.27; 26 8.89,1.27; 27 11.43,-1.27; 28 11.43,1.27; 29 13.97,-1.27; 30 13.97,1.27; 31 16.51,-1.27; 32 16.51,1.27; 33 19.05,-1.27; 34 19.05,1.27; 35 21.59,-1.27; 36 21.59,1.27
LUMBERG-1613_14 = smd 2 x 2.7: 1 5.5,5; 2 5.5,11.1; 3 -5.5,11.1; 4 -5.5,5 | hole 1.6: 0,5 | hole 1.8: 0,9.5
R0402 = smd 0.7 x 0.9: 1 -0.65,0; 2 0.65,0
SOT763-1 = smd 0.8 x 0.35: 1 -1.7,-0.25; 8 1.7,-0.25; 9 1.7,0.25; 16 -1.7,0.25 | smd 0.35 x 0.8: 2 -1.25,-1.2; 3 -0.75,-1.2; 4 -0.25,-1.2; 5 0.25,-1.2; 6 0.75,-1.2; 7 1.25,-1.2; 10 1.25,1.2; 11 0.75,1.2; 12 0.25,1.2; 13 -0.25,1.2; 14 -0.75,1.2; 15 -1.25,1.2 | smd 2.15 x 1.15: PAD 0,0
SOP8 = smd 0.76 x 1.27: 1 -3.81,-2.86; 2 -1.27,-2.86; 3 1.27,-2.86; 4 3.81,-2.86; 5 3.81,2.86; 6 1.27,2.86; 7 -1.27,2.86; 8 -3.81,2.86

### Placement (x,y rotation side)
AUDIO_IN  11.7,27.6 90 top
CPUMP1  30.9,56.8 0 top
CPUMP2  30.9,31.6 0 top
CVBST1  23.5,49.5 270 top
CVBST2  23.5,24.3 270 top
CVDD1  27.8,58.1 0 top
CVDD2  27.7,32.9 0 top
CVREG1  30.9,55.3 0 top
CVREG2  30.9,30.1 0 top
DRV1  25.5,54.4 270 top
DRV2  25.5,29.2 270 top
GND_LIFT  4.9,58.7 0 top
JP1  29.8,2.3 0 top
JP2  50.1,2.3 0 top
L1  20.2,54.4 180 top
L2  20.2,29.2 180 top
LED1  67,4.4 90 top
LED2  72,4.4 90 top
LED3  77,4.4 90 top
LED_SUP  3.2,77.9 180 top
PIEZO_HEADER_A1  74.5,40 90 top
PWR:  0.4,70 270 top
R_1A  58.1,9.9 270 top
R_1B  63.1,9.9 270 top
R_1C  47.7,9.9 270 top
R_1D  52.8,9.9 270 top
R_1E  37.3,9.9 270 top
R_1F  42.4,9.9 270 top
R_1G  65.7,45.1 90 top
R_1H  60.7,45.1 90 top
R_1J  55.4,45.1 90 top
R_2A  50.3,45.1 90 top
R_2B  44.9,45.1 90 top
R_2C  39.9,45.1 90 top
R_2D  37.3,59.9 270 top
R_2E  42.4,59.9 270 top
R_2F  47.7,59.9 270 top
R_2G  52.7,59.9 270 top
R_2H  58.1,59.9 270 top
R_2J  63.2,59.9 270 top
R_CLR  19.6,6 270 top
R_GND1  11.3,57.7 180 top
R_GND2  11.3,59.6 0 top
R_LOAD  27.3,6 90 top
R_OE  29.6,6 90 top
R_SCL  33.6,6 90 top
R_SDA  36.1,6 90 top
REXT1  28.1,51.2 180 top
REXT2  28.1,26 180 top
RLED1  67,8.4 270 top
RLED2  72,8.4 270 top
RLED3  77,8.4 270 top
RLED_SUP  7.5,77.9 0 top
RVBST1-1  25.5,58.7 90 top
RVBST1-2  23.2,58.1 0 top
RVBST2-1  25.5,33.5 90 top
RVBST2-2  23.2,32.9 0 top
SHIFTER1  32.8,15 180 top
SHIFTER2  32.8,41.2 180 top
SHIFTER3  32.8,65.8 180 top
SSR_1AB  61.9,15 0 top
SSR_1CD  51.5,15 0 top
SSR_1EF  41.1,15 0 top
SSR_1GH  61.9,40 180 top
SSR_1J/2A  51.5,40 180 top
SSR_2BC  41.1,40 180 top
SSR_2DE  41.1,65 0 top
SSR_2FG  51.5,65 0 top
SSR_2HJ  61.9,65 0 top

### Tracks (layer width: path | path; a pad name or v marks a point on that pad's centre or on a via)
0V  (via drill 0.3)
  Top 0.3: DRV1.PAD7 24.51,55.39 DRV1.6 | DRV2.PAD7 24.51,30.19 DRV2.6 | 30.55,66.05 SHIFTER3.8 32.55,66.05 SHIFTER3.PAD | SHIFTER2.8 32.55,41.45 SHIFTER2.PAD | SHIFTER1.8 32.55,15.25 arc-90 SHIFTER1.PAD
  other vias: 30.3,42.4 28.2,49.7 30.6,59 30.5,17.5 32.5,26 46.3,29.2 48.9,31.8 43.7,26.6 41.1,24.1 37.2,26.8 40.1,29.7 42.1,32.9 38.4,51.4 41.9,54.6 49.4,50.5 25,44.2 27.1,17.5 31.4,9.3 19.9,64.9 25.7,67.1 32,69.1 47.6,4.7 42.5,4.7 35.9,33.8 31.8,34.7
  pour Top (isolate 0.1): 0,80 80,80 80,0 0,0
  pour Bottom (isolate 0.1): 0,0 80,0 80,80 0,80
+5V  (via drill 0.3, 1)
  Top 0.3: RLED_SUP.2 8.15,75.15 8.1,75.5 | L2.2 19.4,29.2 | R_2J.2 63.95,59.25 v64.8,58.4 | R_2H.2 58.85,59.25 v59.7,58.4 | R_2G.2 53.45,59.25 v54.3,58.4 | R_2F.2 48.45,59.25 v49.3,58.4 | R_2E.2 43.15,59.25 v44,58.4 | DRV1.2 26.01,57.11 27,58.1 CVDD1.1 27.15,59.85 v28.4,61.1 | v33.6,61.1 35.45,59.25 R_2D.2 37.75,59.25 v38.6,58.4 | R_1G.2 65.65,45.7 v63.2,45.7 60.75,45.7 arc-90 R_1H.2 | R_1J.2 55.4,45.9 v56.4,46.9 | v52.4,45.8 50.35,45.8 R_2A.2 R_2B.2 R_2C.2 39.35,45.75 v38.35,44.75 | DRV2.2 26.01,31.86 CVDD2.1 | CVDD2.1 27,32.9 | 63.05,9.3 R_1B.2 63.1,8.5 v62.4,7.8 | CVDD2.1 27,32.95 27,36.8 | R_CLR.2 19.6,5.4 v17.1,5.4 | LED3.A LED2.A v69.5,2.9 LED1.A | R_1A.2 58.1,9.2 v55.6,9.2 52.8,9.2 R_1D.2 | R_1F.2 42.4,9.2 v45,9.2 47.7,9.2 R_1C.2 | R_1E.2 37.55,9.25 v38.7,8.1 | SHIFTER2.16 35.25,40.95 v35.6,40.6 | SHIFTER3.16 35.75,65.55 v36.1,65.2 | SHIFTER1.16 34.7,14.75 v34.7,11.2 | R_OE.2 29.6,9.3 v31,10.7 | R_SCL.2 R_SDA.2 36.65,6.65 38.69,4.61 JP1.8
  Top 0.8: R_GND2.2 17.1,59.6
  Top 1.2: L1.2 17.1,54.4 | L2.2 v17.1,29.2
  Top 2: PWR:.4 8.1,75.5 PWR:.3 17.1,69.9 17.1,59.6 17.1,54.4 v17.1,36.8 27,36.8 v30.4,36.8
  Bottom 0.3: v28.4,61.1 v33.6,61.1 36.1,63.6 v36.1,65.2 | v38.6,58.4 v44,58.4 47.9,54.5 47.9,54.3 | v63.2,45.7 57.6,45.7 v56.4,46.9 53.5,46.9 v52.4,45.8 | v49.3,58.4 51.5,56.2 51.5,55.7 | v59.7,58.4 62.3,55.8 62.3,55.7 | v64.8,58.4 62.1,55.7 61.9,55.7 | v54.3,58.4 57,55.7 | v17.1,5.4 17.1,3.8 20,0.9 37.29,0.9 JP1.8 v38.69,8.09 v38.7,8.1 | v38.7,8.1 39.8,9.2 v45,9.2 v55.6,9.2 61,9.2 v62.4,7.8 67.3,2.9 v69.5,2.9 | v38.7,8.1 37.8,8.1 v34.7,11.2 31.5,11.2 v31,10.7 | v35.6,40.6 35.25,40.95 34.55,40.95
  Bottom 2: v17.1,5.4 v17.1,29.2 v17.1,36.8 | v30.4,36.8 34.55,40.95 v38.35,44.75 47.9,54.3 49.3,55.7 51.5,55.7 57,55.7 61.9,55.7 62.3,55.7
CH1_I+  (via drill 0.3)
  Top 0.3: DRV1.17 28.51,53.89 29.6,52.8 v29.6,52.5
  Bottom 0.3: AUDIO_IN.24 17.12,40.02 v29.6,52.5
CH1_I-  (via drill 0.3)
  Top 0.3: DRV1.16 28.09,53.41 28.4,53.1 v28.4,52.5
  Bottom 0.3: AUDIO_IN.12 17.7,41.39 28.4,52.09 v28.4,52.5
CH1_O+  (via drill 0.3)
  Top 0.3: SSR_1EF.7 41.59,16.1 43.15,16.1 SSR_1EF.5 45,17.95 v45,19.7 | SSR_1AB.5 63.95,16.1 62.39,16.1 SSR_1AB.7 60.6,17.89 v60.6,19.7 | v50.2,19.7 50.2,17.89 SSR_1CD.7 51.99,16.1 53.55,16.1 SSR_1CD.5 v55.3,19.7 | SSR_1J/2A.7 v54.51,35.4 56.35,35.4 SSR_1GH.5 59.83,35.4 v60.6,35.4 61.43,35.4 SSR_1GH.7 | DRV1.13 25.5,49.2 28,46.7 v30.8,46.7 | v36.5,46.7 v43.4,46.7
  Bottom 0.3: v45,19.7 v50.2,19.7 | v55.3,19.7 v60.6,19.7 v60.6,35.4 | v30.8,46.7 v36.5,46.7 | v43.4,46.7 43.4,36.9 45.5,34.8 53.91,34.8 v54.51,35.4
CH1_O-  (via drill 0.3)
  Top 0.3: v36.5,47.9 v54.2,47.9 | v31.6,47.9 28.2,47.9 26.01,50.09 DRV1.14 | PIEZO_HEADER_A1.17 PIEZO_HEADER_A1.1
  Bottom 0.3: v31.6,47.9 v36.5,47.9 | v54.2,47.9 62.6,47.9 70.5,40 74.5,40 PIEZO_HEADER_A1.17 PIEZO_HEADER_A1.15 PIEZO_HEADER_A1.13 PIEZO_HEADER_A1.11 PIEZO_HEADER_A1.9 PIEZO_HEADER_A1.7 PIEZO_HEADER_A1.5 PIEZO_HEADER_A1.3 PIEZO_HEADER_A1.1
CH1_PA+
  Top 0.3: PIEZO_HEADER_A1.2 68.39,15 60.95,15 SSR_1AB.8
CH1_PB+
  Top 0.3: PIEZO_HEADER_A1.4 66.26,20.95 SSR_1AB.6
CH1_PC+
  Top 0.3: PIEZO_HEADER_A1.6 61.49,23.49 56.7,18.7 56.7,17 54.7,15 50.55,15 SSR_1CD.8
CH1_PD+
  Top 0.3: PIEZO_HEADER_A1.8 59.03,26.03 52.77,19.77 SSR_1CD.6
CH1_PE+
  Top 0.3: PIEZO_HEADER_A1.10 56.17,28.57 46.4,18.8 46.4,17 44.4,15 40.15,15 SSR_1EF.8
CH1_PF+
  Top 0.3: PIEZO_HEADER_A1.12 53.71,31.11 42.37,19.77 SSR_1EF.6
CH1_PG+
  Top 0.3: SSR_1GH.8 69.2,33.65 PIEZO_HEADER_A1.14
CH1_PH+
  Top 0.3: PIEZO_HEADER_A1.16 68.81,36.19 66.5,38.5 61.99,38.5 SSR_1GH.6
CH1_PJ+
  Top 0.3: SSR_1J/2A.8 55.41,37.14 58.07,39.8 67.6,39.8 68.67,38.73 PIEZO_HEADER_A1.18
CH2_I+  (via drill 0.3)
  Top 0.3: DRV2.17 28.61,28.69 29.6,27.7 v29.6,27.3 | AUDIO_IN.10 14.6,34.25 14.6,28 21.9,20.7 v24.4,20.7
  Bottom 0.3: v29.6,27.3 29.6,25.9 v24.4,20.7
CH2_I-  (via drill 0.3)
  Top 0.3: DRV2.16 27.89,28.21 28.4,27.7 v28.4,27.3 | AUDIO_IN.23 13.75,37.25 15.6,35.4 15.6,28.4 22.1,21.9 v24.4,21.9
  Bottom 0.3: v28.4,27.3 28.4,25.9 v24.4,21.9
CH2_O+  (via drill 0.3)
  Top 0.3: SSR_2BC.5 v39.03,35.4 40.63,35.4 SSR_2BC.7 44.11,35.4 45.95,35.4 v46.02,35.48 SSR_1J/2A.5 | SSR_2DE.7 41.67,69.7 43.07,69.7 SSR_2DE.5 46.75,69.7 48.39,69.7 SSR_2FG.7 52.07,69.7 53.47,69.7 SSR_2FG.5 57.15,69.7 58.79,69.7 SSR_2HJ.7 62.47,69.7 63.87,69.7 SSR_2HJ.5 65.71,67.8 v67.9,67.8 | DRV2.13 25.5,23.6 27.7,21.4 v31.7,21.4
  Bottom 0.3: v67.9,67.8 67.9,58.4 60.3,50.8 55.7,50.8 46.02,41.12 v46.02,35.48 | v31.7,21.4 31.7,23.4 39.03,30.63 v39.03,35.4
CH2_O-  (via drill 0.3)
  Top 0.3: PIEZO_HEADER_A1.35 PIEZO_HEADER_A1.33 PIEZO_HEADER_A1.31 PIEZO_HEADER_A1.29 PIEZO_HEADER_A1.27 PIEZO_HEADER_A1.25 PIEZO_HEADER_A1.23 PIEZO_HEADER_A1.21 PIEZO_HEADER_A1.19 74.5,40 74.5,33.1 73.8,32.4 52.3,32.4 42,22.1 v37.6,22.1 | DRV2.14 26.01,23.89 27.8,22.1 v32.5,22.1
  Bottom 0.3: v32.5,22.1 v37.6,22.1 | PIEZO_HEADER_A1.35 PIEZO_HEADER_A1.19
CH2_PA+
  Top 0.3: SSR_1J/2A.6 51.69,38.6 55,38.6 57.67,41.27 PIEZO_HEADER_A1.20
CH2_PB+
  Top 0.3: PIEZO_HEADER_A1.22 69.89,43.81 66.8,46.9 58.1,46.9 56.7,45.5 56.7,42.2 54,39.5 47.27,39.5 SSR_2BC.8
CH2_PC+
  Top 0.3: PIEZO_HEADER_A1.24 69.65,46.35 68.1,47.9 55.9,47.9 54.1,46.1 54.1,42.1 52.4,40.4 43.09,40.4 SSR_2BC.6
CH2_PD+
  Top 0.3: SSR_2DE.8 40.15,65 42.2,65 43.7,63.5 43.7,61.1 55.91,48.89 PIEZO_HEADER_A1.26
CH2_PE+
  Top 0.3: SSR_2DE.6 45.23,65 47,65 48.9,63.1 48.9,60.9 58.37,51.43 PIEZO_HEADER_A1.28
CH2_PF+
  Top 0.3: SSR_2FG.8 50.55,65 52.3,65 54,63.3 54,61.1 61.13,53.97 PIEZO_HEADER_A1.30
CH2_PG+
  Top 0.3: SSR_2FG.6 55.63,65 57.7,65 59.4,63.3 59.4,60.9 63.8,56.5 71.79,56.5 PIEZO_HEADER_A1.32
CH2_PH+
  Top 0.3: SSR_2HJ.8 60.95,65 63,65 64.5,63.5 64.5,61.4 66.85,59.05 PIEZO_HEADER_A1.34
CH2_PJ+
  Top 0.3: SSR_2HJ.6 69.44,61.59 PIEZO_HEADER_A1.36
GND
  Top 0.5: AUDIO_IN.2 12.97,14.63 10.43,17.17 AUDIO_IN.16 10.43,18.73 12.97,21.27 AUDIO_IN.5 12.97,22.93 10.43,25.47 AUDIO_IN.19 10.43,27.03 12.97,29.57 AUDIO_IN.8 12.97,31.13 10.43,33.67 10.43,34 AUDIO_IN.22 10.43,35.07 8.8,36.7 8.8,37.8 9.65,38.65 AUDIO_IN.11 12.97,39.43 10.43,41.97 AUDIO_IN.25 2.4,50.82 GND_LIFT.1 GND_LIFT.6
LED1
  Top 0.3: RLED1.1 66.05,9.05 62.5,5.5 52.03,5.5 JP2.4
LED2
  Top 0.3: RLED2.1 71.05,9.05 69.7,7.7 69.7,6 68.5,4.8 53.87,4.8 JP2.5
LED3
  Top 0.3: RLED3.1 76.05,9.05 74.6,7.6 74.6,5.4 73.2,4 55.61,4 JP2.6
N$2
  Top 0.3: DRV1.7 23.52,54.7 DRV1.8
  Top 0.4: 23.52,54.7 23.55,54.66
  Top 0.8: 23.55,54.66 21.25,54.66
  Top 1: 21.25,54.66 L1.1
N$3  (via drill 0.3)
  Top 0.3: DRV1.10 23.5,53.11 | DRV1.12 DRV1.11 24.51,52.4 24.73,52.4 | RVBST1-1.2 v25.5,60.3
  Top 0.8: 23.5,53.11 23.5,52.4 | 23.5,52.4 24.73,52.4 | 23.5,52.4 v23.5,52.2 CVBST1.1
  Bottom 0.3: v25.5,60.3 23.5,58.3 v23.5,52.2
N$4
  Top 0.3: DRV1.3 RVBST1-1.1 25.5,58.1 RVBST1-2.2
N$5
  Top 0.3: DRV1.15 26.49,52.16 REXT1.2
N$6
  Top 0.3: CPUMP1.1 29.83,56.38 DRV1.1
N$7
  Top 0.3: DRV1.20 30.16,55.39 CVREG1.1
N$15
  Top 0.3: LED_SUP.A RLED_SUP.1
N$21
  Top 0.3: DRV2.7 23.52,29.45 DRV2.8
  Top 0.4: 23.52,29.45 23.53,29.45
  Top 0.8: 23.53,29.45 21.25,29.45 L2.1
N$22  (via drill 0.3)
  Top 0.3: DRV2.10 23.5,28.21 23.5,27.96 | DRV2.11 DRV2.12 24.99,27.2 24.7,27.2 | RVBST2-1.2 v25.5,35.1
  Top 0.8: 23.5,27.2 v23.5,27 CVBST2.1 | 23.5,27.96 23.5,27.2 | 23.5,27.2 24.7,27.2
  Bottom 0.3: v25.5,35.1 23.5,33.1 v23.5,27
N$23
  Top 0.3: DRV2.3 RVBST2-1.1 23.9,32.85 RVBST2-2.2
N$24
  Top 0.3: DRV2.15 26.49,26.96 REXT2.2
N$25
  Top 0.3: DRV2.1 29.83,31.18 CPUMP2.1
N$26
  Top 0.3: DRV2.20 30.16,30.19 CVREG2.1
N$68
  Top 0.3: RLED3.2 LED3.C
N$69
  Top 0.3: RLED2.2 LED2.C
N$70
  Top 0.3: RLED1.2 LED1.C
N$96
  Top 0.3: SSR_1AB.1 R_1A.1
N$97
  Top 0.3: SSR_1AB.3 63.1,12.07 R_1B.1
N$100
  Top 0.3: SSR_1CD.1 R_1C.1
N$101
  Top 0.3: SSR_1CD.3 52.8,12.11 R_1D.1
N$102
  Top 0.3: SSR_1EF.1 R_1E.1
N$103
  Top 0.3: SSR_1EF.3 42.4,12.11 R_1F.1
N$104
  Top 0.3: R_1G.1 SSR_1GH.1
N$105
  Top 0.3: R_1H.1 60.7,42.93 SSR_1GH.3
N$106
  Top 0.3: R_1J.1 55.4,42.95 SSR_1J/2A.1
N$107
  Top 0.3: R_2A.1 50.3,42.93 SSR_1J/2A.3
N$108
  Top 0.3: R_2B.1 SSR_2BC.1
N$109
  Top 0.3: R_2C.1 39.9,42.93 SSR_2BC.3
N$119
  Top 0.3: SSR_2DE.1 R_2D.1
N$120
  Top 0.3: SSR_2DE.3 42.4,62.14 R_2E.1
N$121
  Top 0.3: SSR_2FG.1 R_2F.1
N$122
  Top 0.3: SSR_2HJ.3 63.2,62.14 R_2J.1
N$123
  Top 0.3: SSR_2HJ.1 R_2H.1
N$124
  Top 0.3: SSR_2FG.3 52.7,62.14 R_2G.1
N$1222
  Top 0.8: R_GND2.1 10.65,58.6 | 10.65,58.6 R_GND1.2 | GND_LIFT.2 4.9,58.6 | 4.9,58.6 10.65,58.6 | GND_LIFT.5 4.9,58.6
REG_CLR  (via drill 0.3)
  Top 0.3: v18.9,59.9 23.6,64.6 SHIFTER3.10 | v18.9,43.7 v18.9,40.7 | JP1.1 20.91,6.65 | 20.91,6.65 20.91,11.8 22.91,13.8 SHIFTER1.10 | R_CLR.1 20.91,6.65 | v25,41.2 26.2,40 SHIFTER2.10
  Bottom 0.3: v18.9,59.9 v18.9,43.7 | v25,41.2 19.4,41.2 v18.9,40.7 18.9,4.31 JP1.1
REG_LOAD  (via drill 0.3)
  Top 0.3: v21.1,59.9 24.2,63 31.7,63 32.55,63.85 SHIFTER3.12 | v21.1,45.9 v21.1,39.6 | JP1.3 25.99,6.65 | 25.99,6.65 25.99,10.2 28.19,12.4 31.9,12.4 32.55,13.05 SHIFTER1.12 | R_LOAD.2 25.99,6.65 | SHIFTER2.12 32.55,39.25 31.9,38.6 24.2,38.6 v23.2,39.6
  Bottom 0.3: v21.1,59.9 v21.1,45.9 | v23.2,39.6 v21.1,39.6 21.1,7.19 JP1.3
REG_OE  (via drill 0.3)
  Top 0.3: v22.2,59.9 24.7,62.4 31.8,62.4 33.05,63.65 SHIFTER3.13 | v22.2,47 v22.2,38.6 22.7,38.1 32.1,38.1 33.05,39.05 SHIFTER2.13 | JP1.4 28.53,5.35 | 28.53,5.35 28.53,9.8 30.63,11.9 32.1,11.9 33.05,12.85 SHIFTER1.13 | R_OE.1 28.53,5.35
  Bottom 0.3: v22.2,59.9 v22.2,47 | v22.2,38.6 22.2,8.63 JP1.4
SPI_MOSI
  Top 0.3: SHIFTER1.14 33.55,9.75 31.07,7.27 JP1.5
SPI_SCLK  (via drill 0.3)
  Top 0.3: v20,59.9 23.7,63.6 31.6,63.6 32.05,64.05 SHIFTER3.11 | v20,44.8 v20,40.2 | JP1.2 23.45,10.8 25.55,12.9 31.7,12.9 32.05,13.25 SHIFTER1.11 | SHIFTER2.11 32.05,39.45 31.8,39.2 25.3,39.2 v24.1,40.4
  Bottom 0.3: v20,59.9 v20,44.8 | v24.1,40.4 20.2,40.4 v20,40.2 20,5.75 JP1.2
SPI_SO1-SI2
  Top 0.3: SHIFTER2.14 33.55,22.05 29.4,17.9 29.4,15.5 30.15,14.75 SHIFTER1.9
SPI_SO2-SI3
  Top 0.3: SHIFTER2.9 30.05,40.95 29.4,41.6 29.4,43.6 32.9,47.1 32.9,61.5 33.55,62.15 SHIFTER3.14
SW-1A
  Top 0.3: SSR_1AB.2 60.63,9.13 57.6,6.1 38.3,6.1 34.05,10.35 SHIFTER1.15
SW-1B
  Top 0.3: SSR_1AB.4 63.95,13.9 60.3,13.9 59.4,13 59.4,8.9 57.2,6.7 38.6,6.7 35.6,9.7 35.6,14.7 35.05,15.25 SHIFTER1.1
SW-1C
  Top 0.3: SSR_1CD.2 50.23,8.13 49.4,7.3 41.3,7.3 38.2,10.4 38.2,12.9 34.9,16.2 SHIFTER1.2
SW-1D
  Top 0.3: SSR_1CD.4 53.55,13.9 49.9,13.9 49,13 49,8.5 48.4,7.9 41.6,7.9 38.9,10.6 38.9,13 34.7,17.2 34,17.2 33.55,16.75 SHIFTER1.3
SW-1E
  Top 0.3: SSR_1EF.2 39.83,12.97 35.1,17.7 33.8,17.7 33.05,16.95 SHIFTER1.4
SW-1F
  Top 0.3: SSR_1EF.4 42.75,14.3 39.4,14.3 35.5,18.2 33.6,18.2 32.55,17.15 SHIFTER1.5
SW-1G  (via drill 0.3)
  Top 0.3: SSR_1GH.2 63.2,42.89 v63.2,44.3 | v49.8,35.7 32.05,17.95 SHIFTER1.6
  Bottom 0.3: v63.2,44.3 62.1,43.2 53.3,43.2 49.4,39.3 49.4,36.1 v49.8,35.7
SW-1H  (via drill 0.3)
  Top 0.3: SSR_1GH.4 v58.1,44.3 | v48.2,35.7 31.55,19.05 SHIFTER1.7
  Bottom 0.3: v58.1,44.3 53,44.3 48.6,39.9 48.6,36.1 v48.2,35.7
SW-1J
  Top 0.3: SSR_1J/2A.2 51.01,41.1 42.5,41.1 41.2,39.8 34.25,39.8 SHIFTER2.15
SW-2A
  Top 0.3: SSR_1J/2A.4 46.63,41.8 42,41.8 40.7,40.5 36.9,40.5 35.95,41.45 SHIFTER2.1
SW-2B
  Top 0.3: SSR_2BC.2 41.96,42.86 40.3,41.2 37.1,41.2 35.9,42.4 SHIFTER2.2
SW-2C
  Top 0.3: SHIFTER2.3 33.55,42.95 33.9,43.3 37.29,43.3 SSR_2BC.4
SW-2D
  Top 0.3: SSR_2DE.2 39.83,58.13 35.1,53.4 35.1,45.2 33.05,43.15 SHIFTER2.4
SW-2E  (via drill 0.3)
  Top 0.3: SSR_2DE.4 44.91,61.69 v46,60.6 | v36.5,58.3 34.4,56.2 34.4,45.2 32.55,43.35 SHIFTER2.5
  Bottom 0.3: v36.5,58.3 38.8,60.6 v46,60.6
SW-2F  (via drill 0.3)
  Top 0.3: SSR_2FG.2 50.23,61.67 v51.3,60.6 | v34.8,58.3 33.6,57.1 33.6,45.1 32.05,43.55 SHIFTER2.6
  Bottom 0.3: v51.3,60.6 49.1,62.8 39.3,62.8 v34.8,58.3
SW-2G  (via drill 0.3)
  Top 0.3: v56.4,60.6 55.31,61.69 SSR_2FG.4 | v30.6,43.7 31.55,42.75 SHIFTER2.7
  Bottom 0.3: v56.4,60.6 53.5,63.5 38.3,63.5 30.6,55.8 30.6,48 29.5,46.9 29.5,44.8 v30.6,43.7
SW-2H  (via drill 0.3)
  Top 0.3: SSR_2HJ.2 60.63,61.67 v61.7,60.6 | SHIFTER3.15 34.45,64.2 v37.2,64.2
  Bottom 0.3: v37.2,64.2 58.1,64.2 v61.7,60.6
SW-2J  (via drill 0.3)
  Top 0.3: SSR_2HJ.4 65.71,61.69 v66.8,60.6 | v37.2,65.6 36.75,66.05 SHIFTER3.1
  Bottom 0.3: v37.2,65.6 61.8,65.6 v66.8,60.6
TWI_SCL  (via drill 0.3)
  Top 0.3: DRV1.18 28.9,54.4 30.5,52.8 30.5,50.5 v28.7,48.7 | DRV2.18 28.9,29.2 30.5,27.6 v30.5,25.5 | R_SCL.1 JP1.6
  Bottom 0.3: v28.7,48.7 27.9,47.9 27.9,35.1 30.5,32.5 v30.5,25.5 23.3,18.3 23.3,12.61 JP1.6
TWI_SDA  (via drill 0.3)
  Top 0.3: DRV1.19 29.29,54.91 31.2,53 31.2,50.1 v29.8,48.7 | DRV2.19 29.19,29.71 31.2,27.7 v31.2,24.6 | 36.15,5.35 R_SDA.1 36.15,5.3 JP1.7
  Bottom 0.3: v29.8,48.7 28.9,47.8 28.9,35.3 31.2,33 v31.2,24.6 24.4,17.8 24.4,14.05 JP1.7

### Text on the board
tPlace: - 5VDC / - 2A min. | 1- | 1+ | 2- | 2+ | 3- | 3+ | 4- | 4+ | 5- | 5+ | 6- | 6+ | 7- | 7+ | 8- | 8+